# Altium project EVK-IRIS-W1-Mikro-Bus.PrjPcb (part 1 of 5)
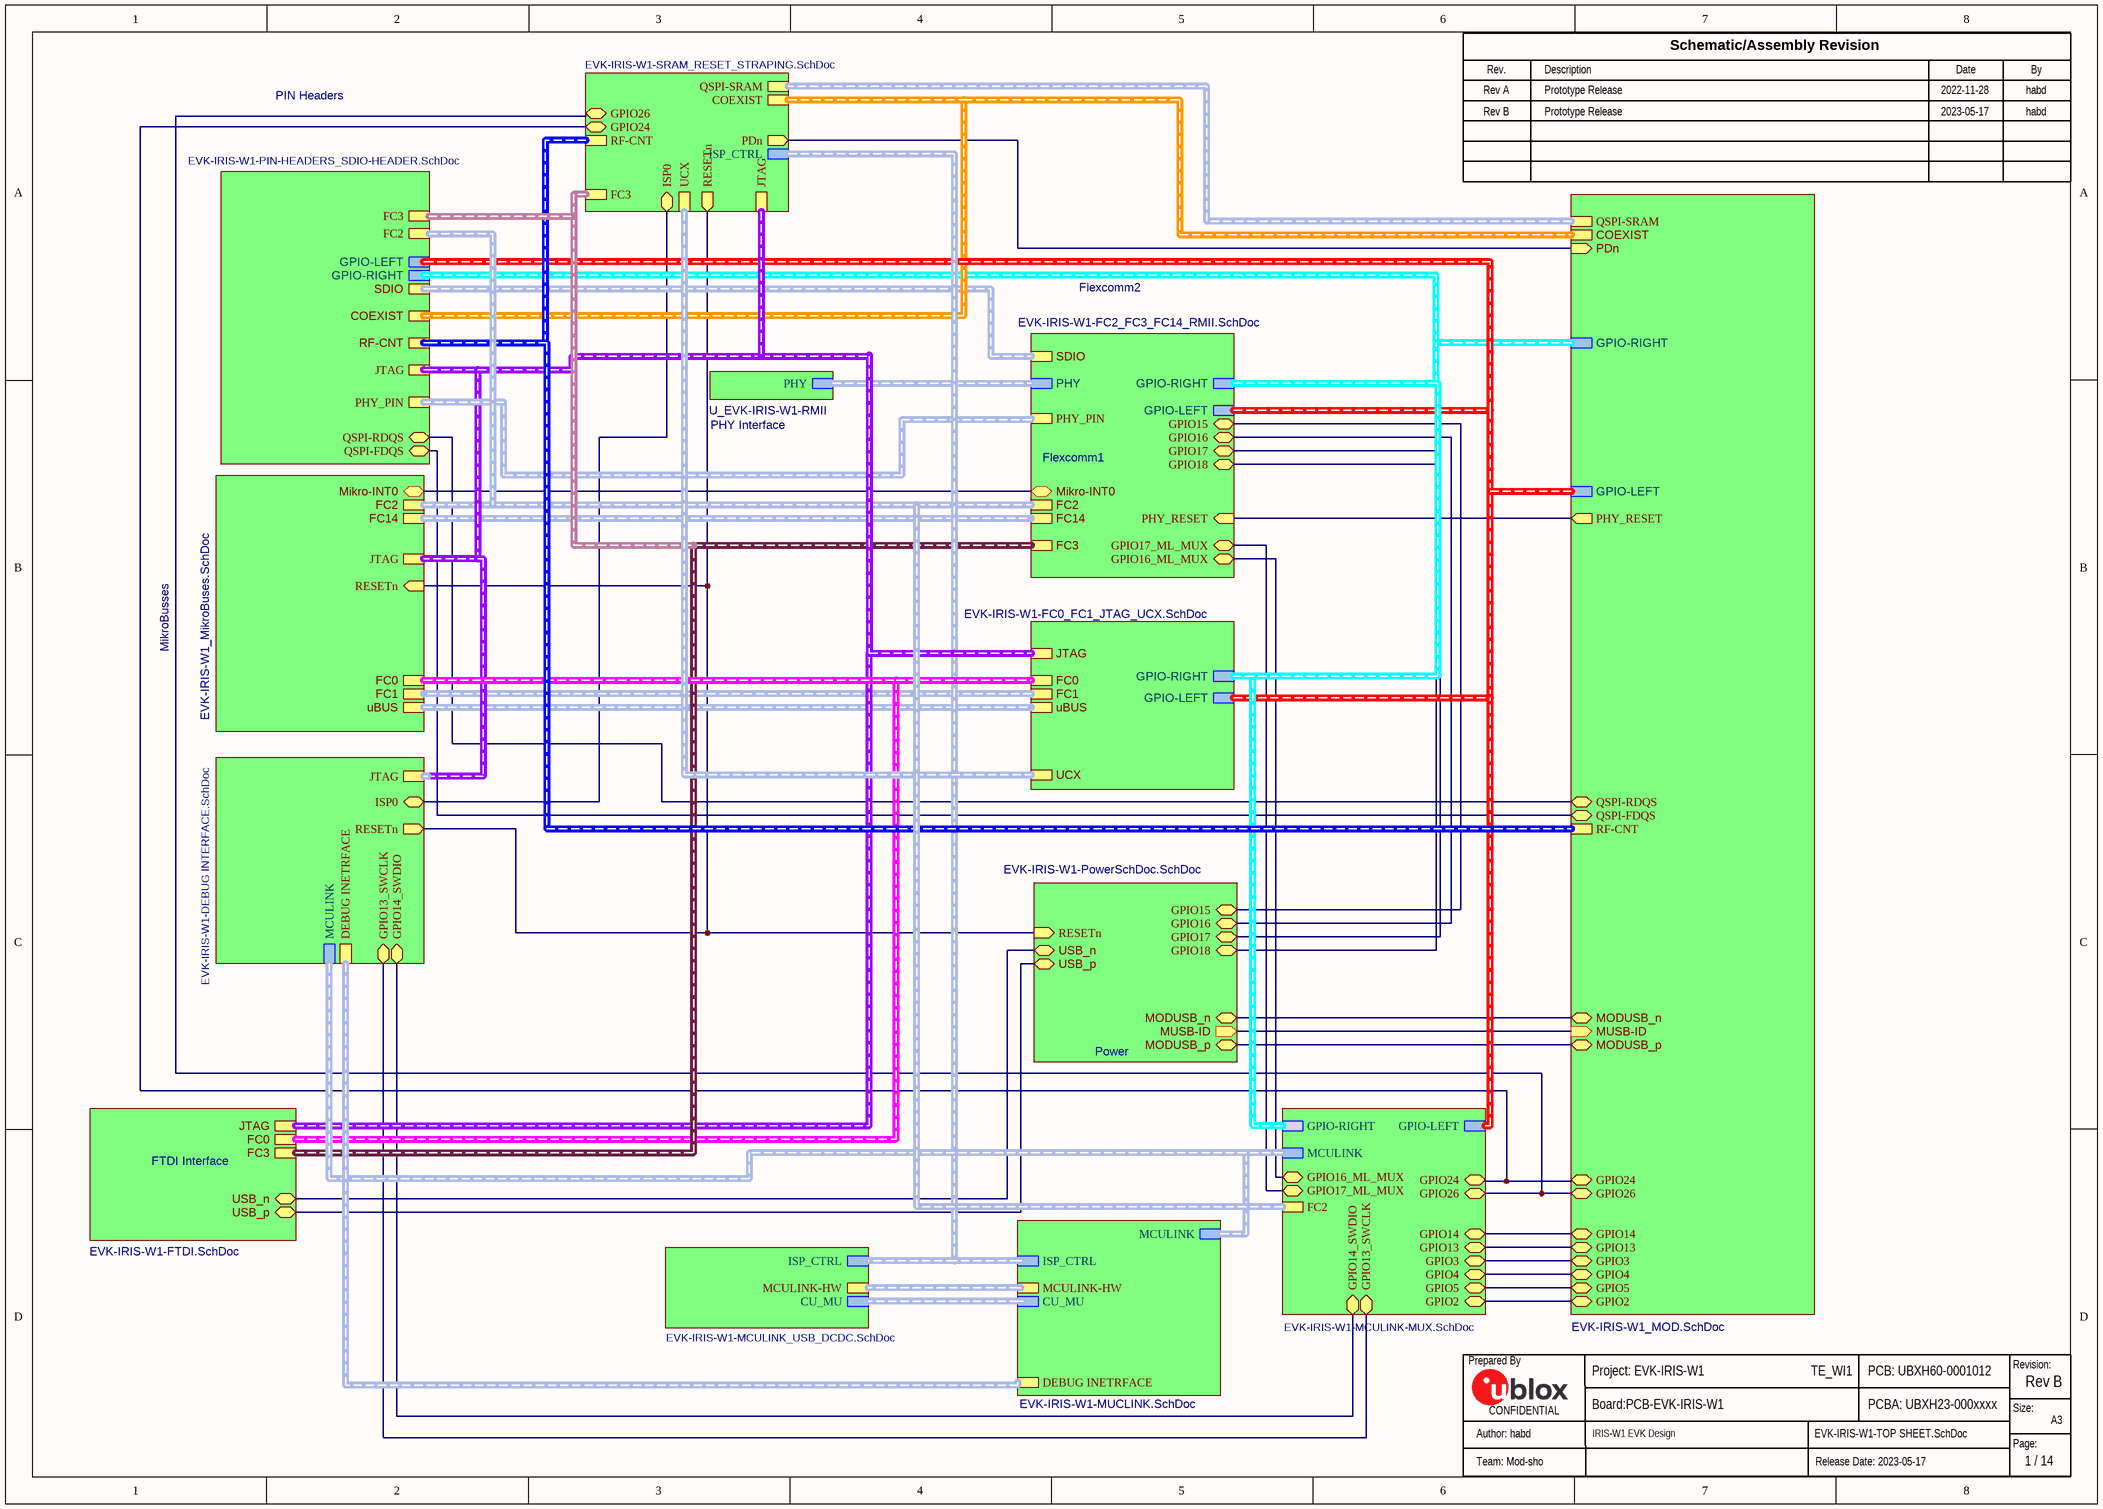
[diagram p0: EVK-IRIS-W1-TOP SHEET.SchDoc]
AssemblyUBXNum: UBXH23-000xxxx; GlobalClientName: u-blox; GlobalCompanyNmae: u-blox AG; GlobalProjectCode: TE_WI1; GlobalProjectDescription: IRIS-W1 EVK Design; GlobalProjectLink: www.u-blox.com; GlobalProjectName: EVK-IRIS-W1; GlobalProjectRevision: Rev B; GlobalProjectTeam: Mod-sho; GlobalReleaseDate: 2023-05-17; PCBDocNum: UBXH60-0001012; PCBName: PCB-EVK-IRIS-W1; PCBUBXNum: UBXH60-0001012; ProjectEngineer: habd; ReleaseBy1: habd; ReleaseBy2: habd; ReleaseDate1: 2022-11-28; ReleaseDate2: 2023-05-17; ReleaseDesc1: Prototype Release; ReleaseDesc2: Prototype Release; ReleaseRev1: Rev A; ReleaseRev2: Rev B; Revision: B; SchDocNum: XXX-XXXX-XX; SchSheetTotal: 14
14 sheets, 619 parts. Net scope: hierarchical (ports join the sheet entries above them; power ports are global).
Board file: EVK-IRIS-W1.PcbDoc
Sheets:
  EVK-IRIS-W1-TOP SHEET.SchDoc
    U_EVK-IRIS-W1-FC0_FC1_JTAG_UCX = EVK-IRIS-W1-FC0_FC1_JTAG_UCX.SchDoc
    U_EVK-IRIS-W1-FC2_FC3_FC14_RMII = EVK-IRIS-W1-FC2_FC3_FC14_RMII.SchDoc
    U_EVK-IRIS-W1-FTDI = EVK-IRIS-W1-FTDI.SchDoc
    U_EVK-IRIS-W1-PIN-HEADERS_SDIO-HEADER = EVK-IRIS-W1-PIN-HEADERS_SDIO-HEADER.SchDoc
    U_EVK-IRIS-W1-PowerSchDoc = EVK-IRIS-W1-PowerSchDoc.SchDoc
    U_EVK-IRIS-W1_MikroBuses = EVK-IRIS-W1_MikroBuses.SchDoc
    U_EVK-IRIS-W1_MOD = EVK-IRIS-W1_MOD.SchDoc
    U_EVK-IRIS-W1-RMII = EVK-IRIS-W1-RMII.SchDoc
    U_EVK-IRIS-W1-MCULINK-MUX = EVK-IRIS-W1-MCULINK-MUX.SchDoc
    U_EVK-IRIS-W1-MUCLINK = EVK-IRIS-W1-MUCLINK.SchDoc
    U_EVK-IRIS-W1-DEBUG INTERFACE = EVK-IRIS-W1-DEBUG INTERFACE.SchDoc
    U_EVK-IRIS-W1-MCULINK_USB_DCDC = EVK-IRIS-W1-MCULINK_USB_DCDC.SchDoc
    U_EVK-IRIS-W1-SRAM_RESET_STRAPING = EVK-IRIS-W1-SRAM_RESET_STRAPING.SchDoc

## Sheet EVK-IRIS-W1-TOP SHEET.SchDoc
size A3; DocumentNumber: 1; SheetNumber: 1; SheetTotal: 14

### Sub-sheets
U_EVK-IRIS-W1-DEBUG INTERFACE = EVK-IRIS-W1-DEBUG INTERFACE.SchDoc: JTAG (harness JTAG), GPIO13_SWCLK (bidir), GPIO14_SWDIO (bidir), DEBUG INETRFACE (harness DEBUG-INTERFACE), ISP0 (bidir), MCULINK (harness MCULINK), RESETn (out)
U_EVK-IRIS-W1-FC0_FC1_JTAG_UCX = EVK-IRIS-W1-FC0_FC1_JTAG_UCX.SchDoc: GPIO-RIGHT (harness GPIO-RIGHT), FC1 (harness FC1), JTAG (harness JTAG), FC0 (harness FC0), UCX (harness UCX), GPIO-LEFT (harness GPIO-LEFT), uBUS (harness uBUS)
U_EVK-IRIS-W1-FC2_FC3_FC14_RMII = EVK-IRIS-W1-FC2_FC3_FC14_RMII.SchDoc: GPIO-RIGHT (harness GPIO-RIGHT), PHY (harness PHY_HARNESS), FC14 (harness FC14), SDIO (harness SDIO), FC2 (harness FC2), FC3 (harness FC3), Mikro-INT0 (bidir), GPIO-LEFT (harness GPIO-LEFT), PHY_PIN (harness PHY_PIN HEADERS), PHY_RESET (in), GPIO15 (bidir), GPIO16 (bidir), GPIO17 (bidir), GPIO18 (bidir), GPIO16_ML_MUX (bidir), GPIO17_ML_MUX (bidir)
U_EVK-IRIS-W1-FTDI = EVK-IRIS-W1-FTDI.SchDoc: USB_n (bidir), USB_p (bidir), JTAG (harness JTAG), FC0 (harness FC0), FC3 (harness FC3)
U_EVK-IRIS-W1-MCULINK-MUX = EVK-IRIS-W1-MCULINK-MUX.SchDoc: GPIO-LEFT (harness GPIO-LEFT), GPIO-RIGHT (harness GPIO-RIGHT), GPIO24 (bidir), GPIO26 (bidir), GPIO14 (bidir), GPIO13 (bidir), GPIO3 (bidir), GPIO4 (bidir), GPIO5 (bidir), GPIO2 (bidir), MCULINK (harness MCULINK), GPIO14_SWDIO (bidir), GPIO13_SWCLK (bidir), GPIO16_ML_MUX (bidir), GPIO17_ML_MUX (bidir), FC2 (harness FC2)
U_EVK-IRIS-W1-MCULINK_USB_DCDC = EVK-IRIS-W1-MCULINK_USB_DCDC.SchDoc: MCULINK-HW (harness MCULINK_HW), CU_MU (harness CU_MU), ISP_CTRL (harness ISP_CTRL)
U_EVK-IRIS-W1-MUCLINK = EVK-IRIS-W1-MUCLINK.SchDoc: MCULINK-HW (harness MCULINK_HW), MCULINK (harness MCULINK), DEBUG INETRFACE (harness DEBUG-INTERFACE), CU_MU (harness CU_MU), ISP_CTRL (harness ISP_CTRL)
U_EVK-IRIS-W1-PIN-HEADERS_SDIO-HEADER = EVK-IRIS-W1-PIN-HEADERS_SDIO-HEADER.SchDoc: GPIO-RIGHT (harness GPIO-RIGHT), RF-CNT (harness RF-CNT), SDIO (harness SDIO), GPIO-LEFT (harness GPIO-LEFT), COEXIST (harness COEXIST), JTAG (harness JTAG), PHY_PIN (harness PHY_PIN HEADERS), QSPI-FDQS (bidir), QSPI-RDQS (bidir), FC2 (harness FC2), FC3 (harness FC3)
U_EVK-IRIS-W1-PowerSchDoc = EVK-IRIS-W1-PowerSchDoc.SchDoc: MODUSB_p (bidir), MODUSB_n (bidir), USB_n (bidir), USB_p (bidir), MUSB-ID (out), RESETn (in), GPIO16 (bidir), GPIO17 (bidir), GPIO18 (bidir), GPIO15 (bidir)
U_EVK-IRIS-W1-RMII = EVK-IRIS-W1-RMII.SchDoc: PHY (harness PHY_HARNESS)
U_EVK-IRIS-W1-SRAM_RESET_STRAPING = EVK-IRIS-W1-SRAM_RESET_STRAPING.SchDoc: PDn (out), QSPI-SRAM (harness QSPI-SRAM), RF-CNT (harness RF-CNT), COEXIST (harness COEXIST), ISP_CTRL (harness ISP_CTRL), ISP0 (bidir), GPIO24 (bidir), GPIO26 (bidir), UCX (harness UCX), FC3 (harness FC3), RESETn (out), JTAG (harness JTAG)
U_EVK-IRIS-W1_MikroBuses = EVK-IRIS-W1_MikroBuses.SchDoc: FC0 (harness FC0), Mikro-INT0 (bidir), FC14 (harness FC14), FC1 (harness FC1), FC2 (harness FC2), uBUS (harness uBUS), JTAG (harness JTAG), RESETn (in)
U_EVK-IRIS-W1_MOD = EVK-IRIS-W1_MOD.SchDoc: COEXIST (harness COEXIST), MODUSB_p (bidir), MODUSB_n (bidir), GPIO-RIGHT (harness GPIO-RIGHT), GPIO-LEFT (harness GPIO-LEFT), PDn (in), MUSB-ID (in), PHY_RESET (out), GPIO24 (bidir), GPIO26 (bidir), GPIO14 (bidir), GPIO13 (bidir), GPIO2 (bidir), GPIO3 (bidir), GPIO4 (bidir), GPIO5 (bidir), RF-CNT (harness RF-CNT), QSPI-RDQS (bidir), QSPI-SRAM (harness QSPI-SRAM), QSPI-FDQS (bidir)

### Nets
DBGIF_ISP0_CTRL: sheet U_EVK-IRIS-W1-DEBUG INTERFACE/ISP0, sheet U_EVK-IRIS-W1-SRAM_RESET_STRAPING/ISP0
GPIO2: sheet U_EVK-IRIS-W1_MOD/GPIO2, sheet U_EVK-IRIS-W1-MCULINK-MUX/GPIO2
GPIO3: sheet U_EVK-IRIS-W1_MOD/GPIO3, sheet U_EVK-IRIS-W1-MCULINK-MUX/GPIO3
GPIO4: sheet U_EVK-IRIS-W1_MOD/GPIO4, sheet U_EVK-IRIS-W1-MCULINK-MUX/GPIO4
GPIO5: sheet U_EVK-IRIS-W1_MOD/GPIO5, sheet U_EVK-IRIS-W1-MCULINK-MUX/GPIO5
GPIO13: sheet U_EVK-IRIS-W1_MOD/GPIO13, sheet U_EVK-IRIS-W1-MCULINK-MUX/GPIO13
GPIO13_SWCLK_ML: sheet U_EVK-IRIS-W1-MCULINK-MUX/GPIO13_SWCLK, sheet U_EVK-IRIS-W1-DEBUG INTERFACE/GPIO13_SWCLK
GPIO14: sheet U_EVK-IRIS-W1_MOD/GPIO14, sheet U_EVK-IRIS-W1-MCULINK-MUX/GPIO14
GPIO14_SWDIO_ML: sheet U_EVK-IRIS-W1-MCULINK-MUX/GPIO14_SWDIO, sheet U_EVK-IRIS-W1-DEBUG INTERFACE/GPIO14_SWDIO
GPIO15: sheet U_EVK-IRIS-W1-FC2_FC3_FC14_RMII/GPIO15, sheet U_EVK-IRIS-W1-PowerSchDoc/GPIO15
GPIO16: sheet U_EVK-IRIS-W1-FC2_FC3_FC14_RMII/GPIO16, sheet U_EVK-IRIS-W1-PowerSchDoc/GPIO16
GPIO17: sheet U_EVK-IRIS-W1-FC2_FC3_FC14_RMII/GPIO17, sheet U_EVK-IRIS-W1-PowerSchDoc/GPIO17
GPIO18: sheet U_EVK-IRIS-W1-FC2_FC3_FC14_RMII/GPIO18, sheet U_EVK-IRIS-W1-PowerSchDoc/GPIO18
GPIO18__Mikro-INT0: sheet U_EVK-IRIS-W1-FC2_FC3_FC14_RMII/Mikro-INT0, sheet U_EVK-IRIS-W1_MikroBuses/Mikro-INT0
GPIO24: sheet U_EVK-IRIS-W1_MOD/GPIO24, sheet U_EVK-IRIS-W1-MCULINK-MUX/GPIO24, sheet U_EVK-IRIS-W1-SRAM_RESET_STRAPING/GPIO24
GPIO26: sheet U_EVK-IRIS-W1_MOD/GPIO26, sheet U_EVK-IRIS-W1-MCULINK-MUX/GPIO26, sheet U_EVK-IRIS-W1-SRAM_RESET_STRAPING/GPIO26
GPIO29_QSPI-FDQS: sheet U_EVK-IRIS-W1-PIN-HEADERS_SDIO-HEADER/QSPI-FDQS, sheet U_EVK-IRIS-W1_MOD/QSPI-FDQS
MODUSB-D_n: sheet U_EVK-IRIS-W1-PowerSchDoc/MODUSB_n, sheet U_EVK-IRIS-W1_MOD/MODUSB_n
MODUSB-D_p: sheet U_EVK-IRIS-W1-PowerSchDoc/MODUSB_p, sheet U_EVK-IRIS-W1_MOD/MODUSB_p
MUSB-ID: sheet U_EVK-IRIS-W1-PowerSchDoc/MUSB-ID, sheet U_EVK-IRIS-W1_MOD/MUSB-ID
PDn: sheet U_EVK-IRIS-W1_MOD/PDn, sheet U_EVK-IRIS-W1-SRAM_RESET_STRAPING/PDn
PHY_RESET: sheet U_EVK-IRIS-W1-FC2_FC3_FC14_RMII/PHY_RESET, sheet U_EVK-IRIS-W1_MOD/PHY_RESET
QSPI-RDQS: sheet U_EVK-IRIS-W1-PIN-HEADERS_SDIO-HEADER/QSPI-RDQS, sheet U_EVK-IRIS-W1_MOD/QSPI-RDQS
RESETn: sheet U_EVK-IRIS-W1-PowerSchDoc/RESETn, sheet U_EVK-IRIS-W1_MikroBuses/RESETn, sheet U_EVK-IRIS-W1-DEBUG INTERFACE/RESETn, sheet U_EVK-IRIS-W1-SRAM_RESET_STRAPING/RESETn
USB-D_n: sheet U_EVK-IRIS-W1-FTDI/USB_n, sheet U_EVK-IRIS-W1-PowerSchDoc/USB_n
USB-D_p: sheet U_EVK-IRIS-W1-FTDI/USB_p, sheet U_EVK-IRIS-W1-PowerSchDoc/USB_p
NetJ56_1: sheet U_EVK-IRIS-W1-FC2_FC3_FC14_RMII/GPIO16_ML_MUX, sheet U_EVK-IRIS-W1-MCULINK-MUX/GPIO16_ML_MUX
NetJ57_1: sheet U_EVK-IRIS-W1-FC2_FC3_FC14_RMII/GPIO17_ML_MUX, sheet U_EVK-IRIS-W1-MCULINK-MUX/GPIO17_ML_MUX

### Buses and harness runs
harness sheet U_EVK-IRIS-W1-DEBUG INTERFACE/DEBUG INETRFACE = sheet U_EVK-IRIS-W1-MUCLINK/DEBUG INETRFACE
harness sheet U_EVK-IRIS-W1-DEBUG INTERFACE/JTAG = sheet U_EVK-IRIS-W1-FC0_FC1_JTAG_UCX/JTAG = sheet U_EVK-IRIS-W1-FTDI/JTAG = sheet U_EVK-IRIS-W1-PIN-HEADERS_SDIO-HEADER/JTAG = sheet U_EVK-IRIS-W1-SRAM_RESET_STRAPING/JTAG = sheet U_EVK-IRIS-W1_MikroBuses/JTAG
harness sheet U_EVK-IRIS-W1-DEBUG INTERFACE/MCULINK = sheet U_EVK-IRIS-W1-MCULINK-MUX/MCULINK = sheet U_EVK-IRIS-W1-MUCLINK/MCULINK
harness sheet U_EVK-IRIS-W1-FC0_FC1_JTAG_UCX/FC0 = sheet U_EVK-IRIS-W1-FTDI/FC0 = sheet U_EVK-IRIS-W1_MikroBuses/FC0
harness sheet U_EVK-IRIS-W1-FC0_FC1_JTAG_UCX/FC1 = sheet U_EVK-IRIS-W1_MikroBuses/FC1
harness sheet U_EVK-IRIS-W1-FC0_FC1_JTAG_UCX/GPIO-LEFT = sheet U_EVK-IRIS-W1-FC2_FC3_FC14_RMII/GPIO-LEFT = sheet U_EVK-IRIS-W1-MCULINK-MUX/GPIO-LEFT = sheet U_EVK-IRIS-W1-PIN-HEADERS_SDIO-HEADER/GPIO-LEFT = sheet U_EVK-IRIS-W1_MOD/GPIO-LEFT
harness sheet U_EVK-IRIS-W1-FC0_FC1_JTAG_UCX/GPIO-RIGHT = sheet U_EVK-IRIS-W1-FC2_FC3_FC14_RMII/GPIO-RIGHT = sheet U_EVK-IRIS-W1-MCULINK-MUX/GPIO-RIGHT = sheet U_EVK-IRIS-W1-PIN-HEADERS_SDIO-HEADER/GPIO-RIGHT = sheet U_EVK-IRIS-W1_MOD/GPIO-RIGHT
harness sheet U_EVK-IRIS-W1-FC0_FC1_JTAG_UCX/uBUS = sheet U_EVK-IRIS-W1_MikroBuses/uBUS
harness sheet U_EVK-IRIS-W1-FC0_FC1_JTAG_UCX/UCX = sheet U_EVK-IRIS-W1-SRAM_RESET_STRAPING/UCX
harness sheet U_EVK-IRIS-W1-FC2_FC3_FC14_RMII/FC2 = sheet U_EVK-IRIS-W1-MCULINK-MUX/FC2 = sheet U_EVK-IRIS-W1-PIN-HEADERS_SDIO-HEADER/FC2 = sheet U_EVK-IRIS-W1_MikroBuses/FC2
harness sheet U_EVK-IRIS-W1-FC2_FC3_FC14_RMII/FC3 = sheet U_EVK-IRIS-W1-FTDI/FC3 = sheet U_EVK-IRIS-W1-PIN-HEADERS_SDIO-HEADER/FC3 = sheet U_EVK-IRIS-W1-SRAM_RESET_STRAPING/FC3
harness sheet U_EVK-IRIS-W1-FC2_FC3_FC14_RMII/FC14 = sheet U_EVK-IRIS-W1_MikroBuses/FC14
harness sheet U_EVK-IRIS-W1-FC2_FC3_FC14_RMII/PHY = sheet U_EVK-IRIS-W1-RMII/PHY
harness sheet U_EVK-IRIS-W1-FC2_FC3_FC14_RMII/PHY_PIN = sheet U_EVK-IRIS-W1-PIN-HEADERS_SDIO-HEADER/PHY_PIN
harness sheet U_EVK-IRIS-W1-FC2_FC3_FC14_RMII/SDIO = sheet U_EVK-IRIS-W1-PIN-HEADERS_SDIO-HEADER/SDIO
harness sheet U_EVK-IRIS-W1-MCULINK_USB_DCDC/CU_MU = sheet U_EVK-IRIS-W1-MUCLINK/CU_MU
harness sheet U_EVK-IRIS-W1-MCULINK_USB_DCDC/ISP_CTRL = sheet U_EVK-IRIS-W1-MUCLINK/ISP_CTRL = sheet U_EVK-IRIS-W1-SRAM_RESET_STRAPING/ISP_CTRL
harness sheet U_EVK-IRIS-W1-MCULINK_USB_DCDC/MCULINK-HW = sheet U_EVK-IRIS-W1-MUCLINK/MCULINK-HW
harness sheet U_EVK-IRIS-W1-PIN-HEADERS_SDIO-HEADER/COEXIST = sheet U_EVK-IRIS-W1-SRAM_RESET_STRAPING/COEXIST = sheet U_EVK-IRIS-W1_MOD/COEXIST
harness sheet U_EVK-IRIS-W1-PIN-HEADERS_SDIO-HEADER/RF-CNT = sheet U_EVK-IRIS-W1-SRAM_RESET_STRAPING/RF-CNT = sheet U_EVK-IRIS-W1_MOD/RF-CNT
harness sheet U_EVK-IRIS-W1-SRAM_RESET_STRAPING/QSPI-SRAM = sheet U_EVK-IRIS-W1_MOD/QSPI-SRAM

### Notes on the sheet
- PIN Headers
- Flexcomm2
- PHY Interface
- Flexcomm1
- MikroBusses
- Power
- FTDI Interface
- Rev.
- Description
- Schematic/Assembly Revision
- Date
- By
- Prepared By
- Revision:
- CONFIDENTIAL
- Page:
- Size:
- A3

## Sheet EVK-IRIS-W1-FC0_FC1_JTAG_UCX.SchDoc: Top Level Design
size A3; CompanyName: Rigado, LLC; Organization: Rigado; DocumentNumber: 4; SheetNumber: 4; SheetTotal: 14; Website: www.rigado.com; SheetSize: B
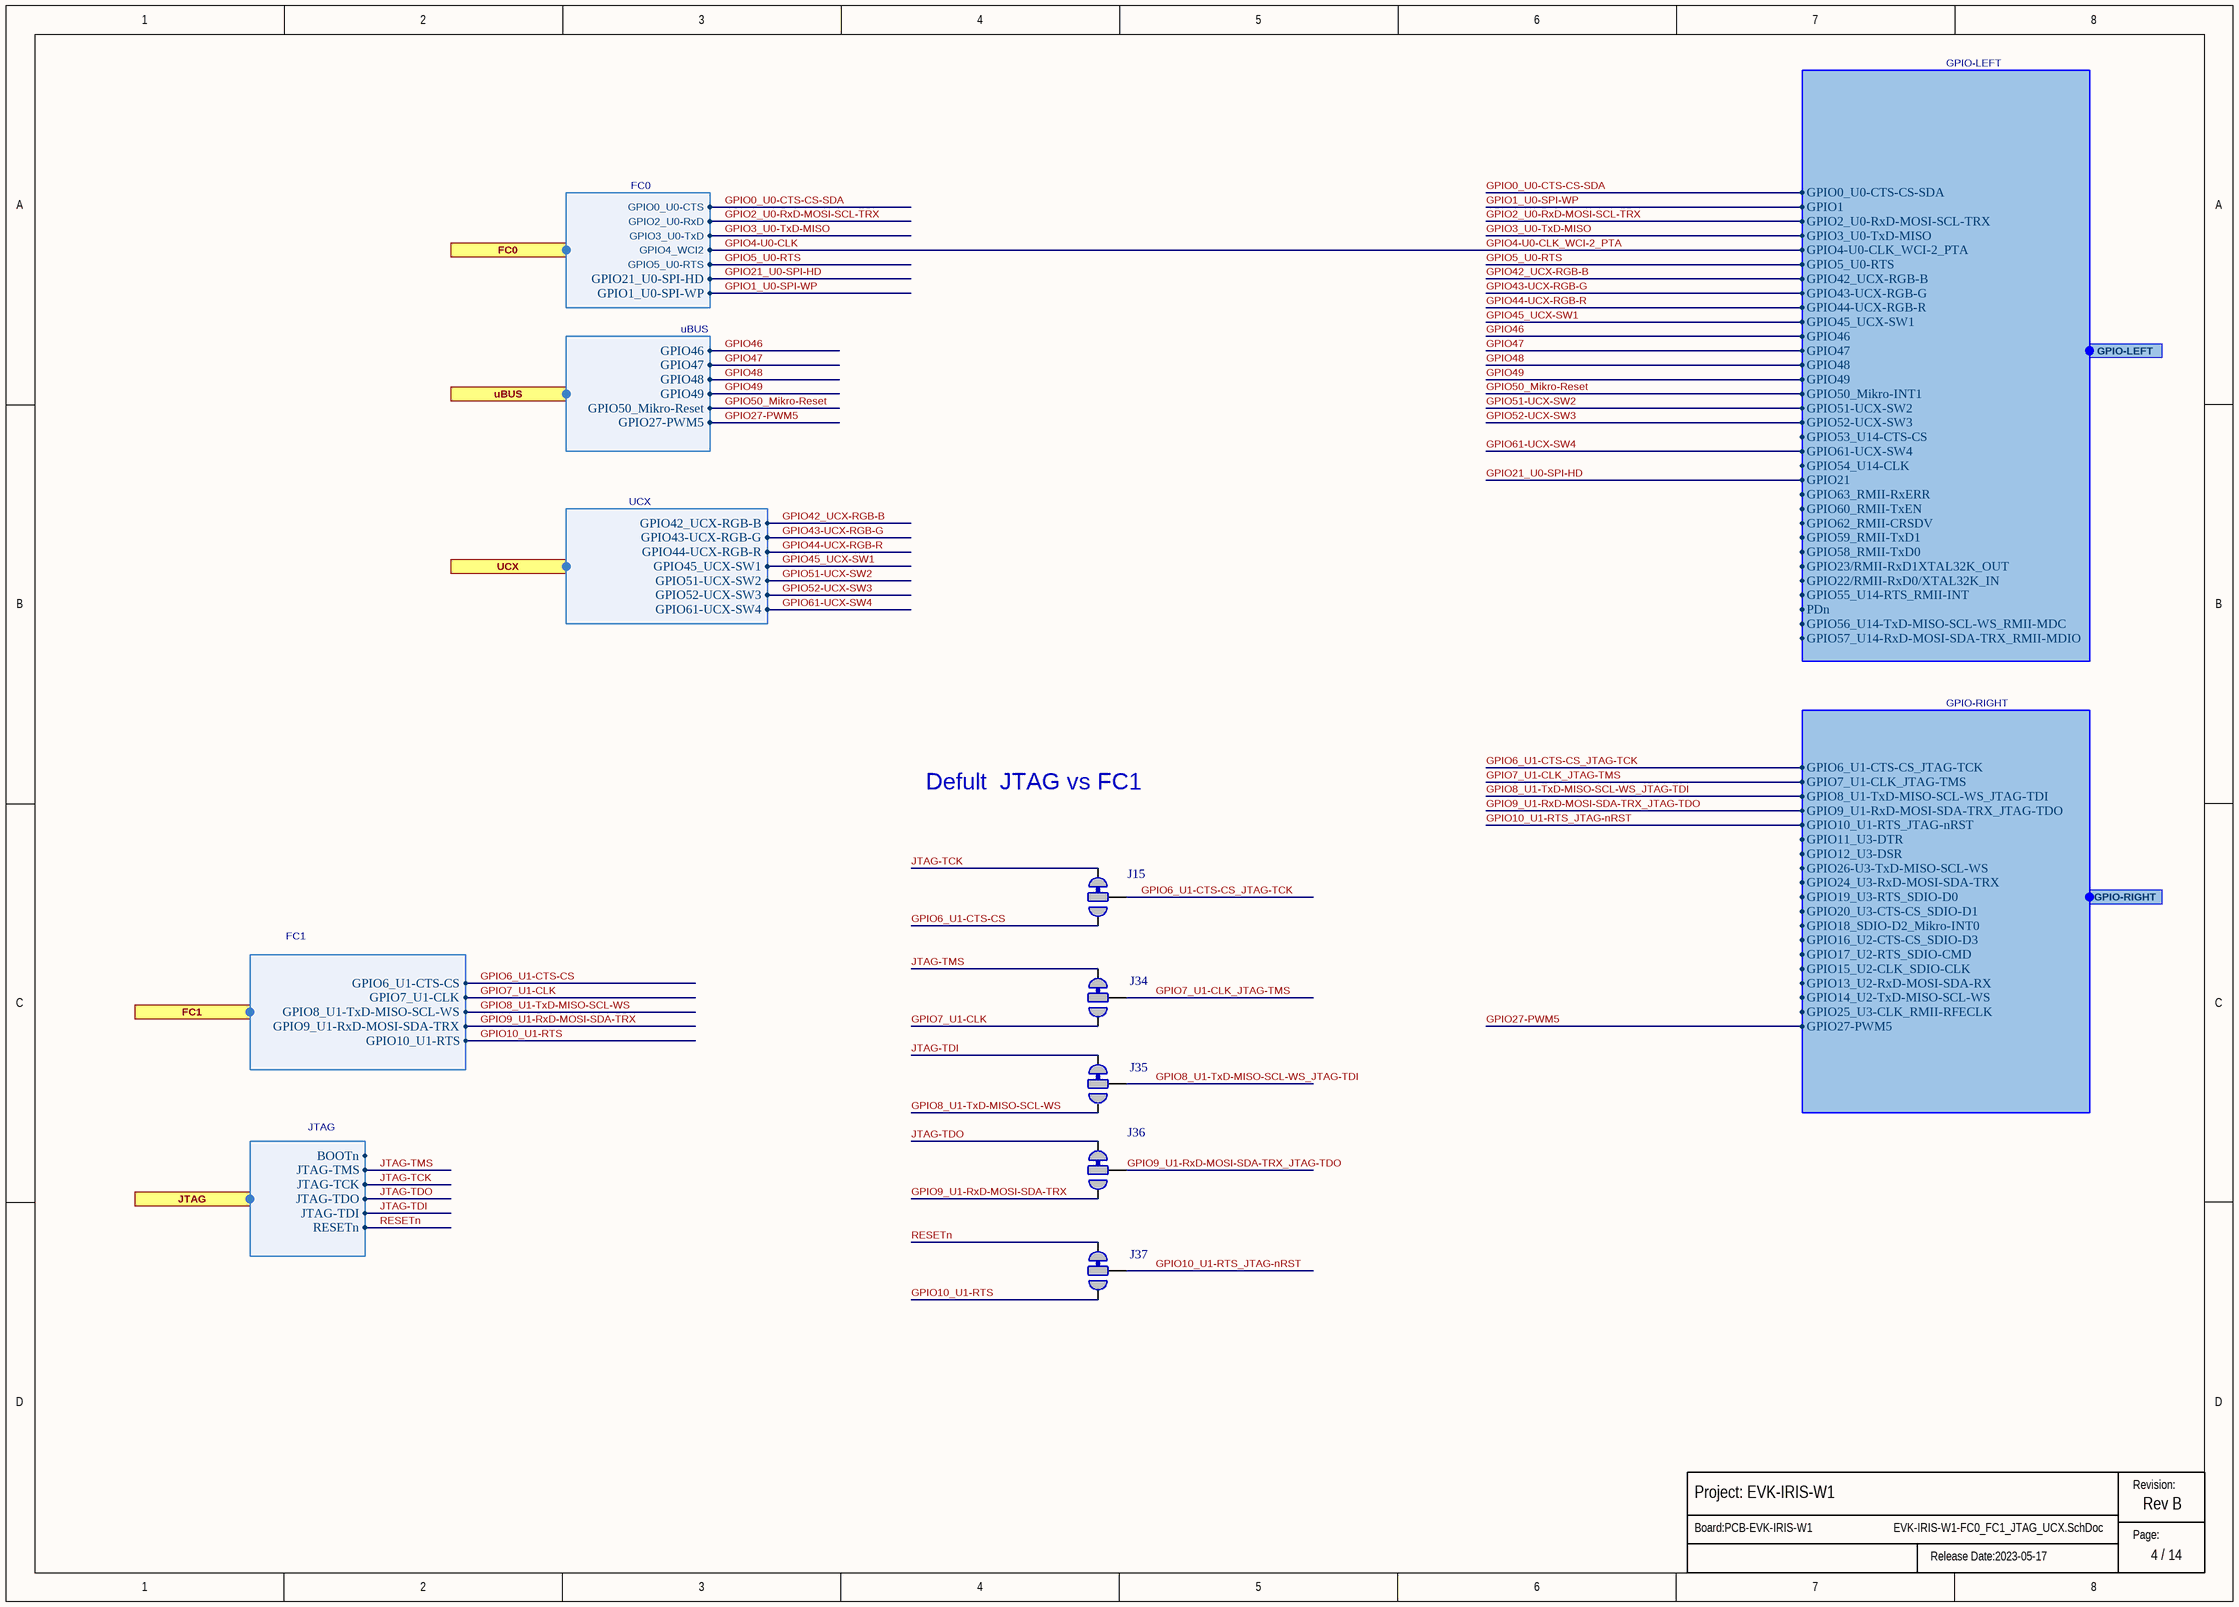
[diagram p1: EVK-IRIS-W1-FC0_FC1_JTAG_UCX.SchDoc]

### Parts
J15  Solderbridge-OptionDNP  [Solderbridge-Option]  (value not drawn)  (net tie, no BOM)
J34  Solderbridge-OptionDNP  [Solderbridge-Option]  (value not drawn)  (net tie, no BOM)
J35  Solderbridge-OptionDNP  [Solderbridge-Option]  (value not drawn)  (net tie, no BOM)
J36  Solderbridge-OptionDNP  [Solderbridge-Option]  (value not drawn)  (net tie, no BOM)
J37  Solderbridge-OptionDNP  [Solderbridge-Option]  (value not drawn)  (net tie, no BOM)

### Ports
FC0 (harness FC0), FC1 (harness FC1), GPIO-LEFT (harness GPIO-LEFT), GPIO-RIGHT (harness GPIO-RIGHT), JTAG (harness JTAG), uBUS (harness uBUS), UCX (harness UCX)

### Harnesses
GPIO-RIGHT: GPIO6_U1-CTS-CS_JTAG-TCK, GPIO7_U1-CLK_JTAG-TMS, GPIO8_U1-TxD-MISO-SCL-WS_JTAG-TDI, GPIO9_U1-RxD-MOSI-SDA-TRX_JTAG-TDO, GPIO10_U1-RTS_JTAG-nRST, GPIO11_U3-DTR, GPIO12_U3-DSR, GPIO26-U3-TxD-MISO-SCL-WS, GPIO24_U3-RxD-MOSI-SDA-TRX, GPIO19_U3-RTS_SDIO-D0, GPIO20_U3-CTS-CS_SDIO-D1, GPIO18_SDIO-D2_Mikro-INT0, GPIO16_U2-CTS-CS_SDIO-D3, GPIO17_U2-RTS_SDIO-CMD, GPIO15_U2-CLK_SDIO-CLK, GPIO13_U2-RxD-MOSI-SDA-RX, GPIO14_U2-TxD-MISO-SCL-WS, GPIO25_U3-CLK_RMII-RFECLK, GPIO27-PWM5
JTAG: JTAG-TCK, JTAG-TDI, JTAG-TDO, JTAG-TMS, RESETn, BOOTn
FC1: GPIO6_U1-CTS-CS, GPIO7_U1-CLK, GPIO8_U1-TxD-MISO-SCL-WS, GPIO9_U1-RxD-MOSI-SDA-TRX, GPIO10_U1-RTS
FC0: GPIO0_U0-CTS, GPIO2_U0-RxD, GPIO3_U0-TxD, GPIO5_U0-RTS, GPIO4_WCI2, GPIO21_U0-SPI-HD, GPIO1_U0-SPI-WP
UCX: GPIO42_UCX-RGB-B, GPIO43-UCX-RGB-G, GPIO44-UCX-RGB-R, GPIO45_UCX-SW1, GPIO51-UCX-SW2, GPIO52-UCX-SW3, GPIO61-UCX-SW4
uBUS: GPIO46, GPIO47, GPIO48, GPIO49, GPIO50_Mikro-Reset, GPIO27-PWM5
GPIO-LEFT: GPIO0_U0-CTS-CS-SDA, GPIO1, GPIO2_U0-RxD-MOSI-SCL-TRX, GPIO3_U0-TxD-MISO, GPIO4-U0-CLK_WCI-2_PTA, GPIO5_U0-RTS, GPIO42_UCX-RGB-B, GPIO43-UCX-RGB-G, GPIO44-UCX-RGB-R, GPIO45_UCX-SW1, GPIO46, GPIO47, GPIO48, GPIO49, GPIO50_Mikro-INT1, GPIO51-UCX-SW2, GPIO52-UCX-SW3, GPIO53_U14-CTS-CS, GPIO61-UCX-SW4, GPIO54_U14-CLK, GPIO21, GPIO63_RMII-RxERR, GPIO60_RMII-TxEN, GPIO62_RMII-CRSDV, GPIO59_RMII-TxD1, GPIO58_RMII-TxD0, GPIO23/RMII-RxD1XTAL32K_OUT, GPIO22/RMII-RxD0/XTAL32K_IN, GPIO55_U14-RTS_RMII-INT, PDn, GPIO56_U14-TxD-MISO-SCL-WS_RMII-MDC, GPIO57_U14-RxD-MOSI-SDA-TRX_RMII-MDIO

### Nets
GPIO0_U0-CTS-CS-SDA: port FC0.GPIO0_U0-CTS, port GPIO-LEFT.GPIO0_U0-CTS-CS-SDA
GPIO1_U0-SPI-WP: port FC0.GPIO1_U0-SPI-WP, port GPIO-LEFT.GPIO1
GPIO2_U0-RxD-MOSI-SCL-TRX: port FC0.GPIO2_U0-RxD, port GPIO-LEFT.GPIO2_U0-RxD-MOSI-SCL-TRX
GPIO3_U0-TxD-MISO: port FC0.GPIO3_U0-TxD, port GPIO-LEFT.GPIO3_U0-TxD-MISO
GPIO4-U0-CLK: port FC0.GPIO4_WCI2, port GPIO-LEFT.GPIO4-U0-CLK_WCI-2_PTA  [also labelled GPIO4-U0-CLK_WCI-2_PTA]
GPIO6_U1-CTS-CS: J15.3 ; port FC1.GPIO6_U1-CTS-CS
GPIO6_U1-CTS-CS_JTAG-TCK: J15.2 ; port GPIO-RIGHT.GPIO6_U1-CTS-CS_JTAG-TCK
GPIO7_U1-CLK: J34.3 ; port FC1.GPIO7_U1-CLK
GPIO7_U1-CLK_JTAG-TMS: J34.2 ; port GPIO-RIGHT.GPIO7_U1-CLK_JTAG-TMS
GPIO8_U1-TxD-MISO-SCL-WS: J35.3 ; port FC1.GPIO8_U1-TxD-MISO-SCL-WS
GPIO8_U1-TxD-MISO-SCL-WS_JTAG-TDI: J35.2 ; port GPIO-RIGHT.GPIO8_U1-TxD-MISO-SCL-WS_JTAG-TDI
GPIO9_U1-RxD-MOSI-SDA-TRX: J36.3 ; port FC1.GPIO9_U1-RxD-MOSI-SDA-TRX
GPIO9_U1-RxD-MOSI-SDA-TRX_JTAG-TDO: J36.2 ; port GPIO-RIGHT.GPIO9_U1-RxD-MOSI-SDA-TRX_JTAG-TDO
GPIO10_U1-RTS: J37.3 ; port FC1.GPIO10_U1-RTS
GPIO10_U1-RTS_JTAG-nRST: J37.2 ; port GPIO-RIGHT.GPIO10_U1-RTS_JTAG-nRST
GPIO21_U0-SPI-HD: port FC0.GPIO21_U0-SPI-HD, port GPIO-LEFT.GPIO21
GPIO27-PWM5: port GPIO-RIGHT.GPIO27-PWM5, port uBUS.GPIO27-PWM5
GPIO42_UCX-RGB-B: port UCX.GPIO42_UCX-RGB-B, port GPIO-LEFT.GPIO42_UCX-RGB-B
GPIO43-UCX-RGB-G: port UCX.GPIO43-UCX-RGB-G, port GPIO-LEFT.GPIO43-UCX-RGB-G
GPIO44-UCX-RGB-R: port UCX.GPIO44-UCX-RGB-R, port GPIO-LEFT.GPIO44-UCX-RGB-R
GPIO45_UCX-SW1: port UCX.GPIO45_UCX-SW1, port GPIO-LEFT.GPIO45_UCX-SW1
GPIO46: port uBUS.GPIO46, port GPIO-LEFT.GPIO46
GPIO47: port uBUS.GPIO47, port GPIO-LEFT.GPIO47
GPIO48: port uBUS.GPIO48, port GPIO-LEFT.GPIO48
GPIO49: port uBUS.GPIO49, port GPIO-LEFT.GPIO49
GPIO50_Mikro-Reset: port uBUS.GPIO50_Mikro-Reset, port GPIO-LEFT.GPIO50_Mikro-INT1
GPIO51-UCX-SW2: port UCX.GPIO51-UCX-SW2, port GPIO-LEFT.GPIO51-UCX-SW2
GPIO52-UCX-SW3: port UCX.GPIO52-UCX-SW3, port GPIO-LEFT.GPIO52-UCX-SW3
GPIO61-UCX-SW4: port UCX.GPIO61-UCX-SW4, port GPIO-LEFT.GPIO61-UCX-SW4
JTAG-TCK: J15.1 ; port JTAG.JTAG-TCK
JTAG-TDI: J35.1 ; port JTAG.JTAG-TDI
JTAG-TDO: J36.1 ; port JTAG.JTAG-TDO
JTAG-TMS: J34.1 ; port JTAG.JTAG-TMS
RESETn: J37.1 ; port JTAG.RESETn

### Notes on the sheet
- Defult  JTAG vs FC1
- Revision:
- Page:

### Library data of the parts
J15 J34-J37 = Solderbridge-Option: Added By: Paul B; Part Number: Solderbridge-Option; Height: 0; DNP: DNP; Added Date: 2015-12-03

## Sheet EVK-IRIS-W1-FC2_FC3_FC14_RMII.SchDoc
size A3; DocumentNumber: 5; SheetNumber: 5; SheetTotal: 14
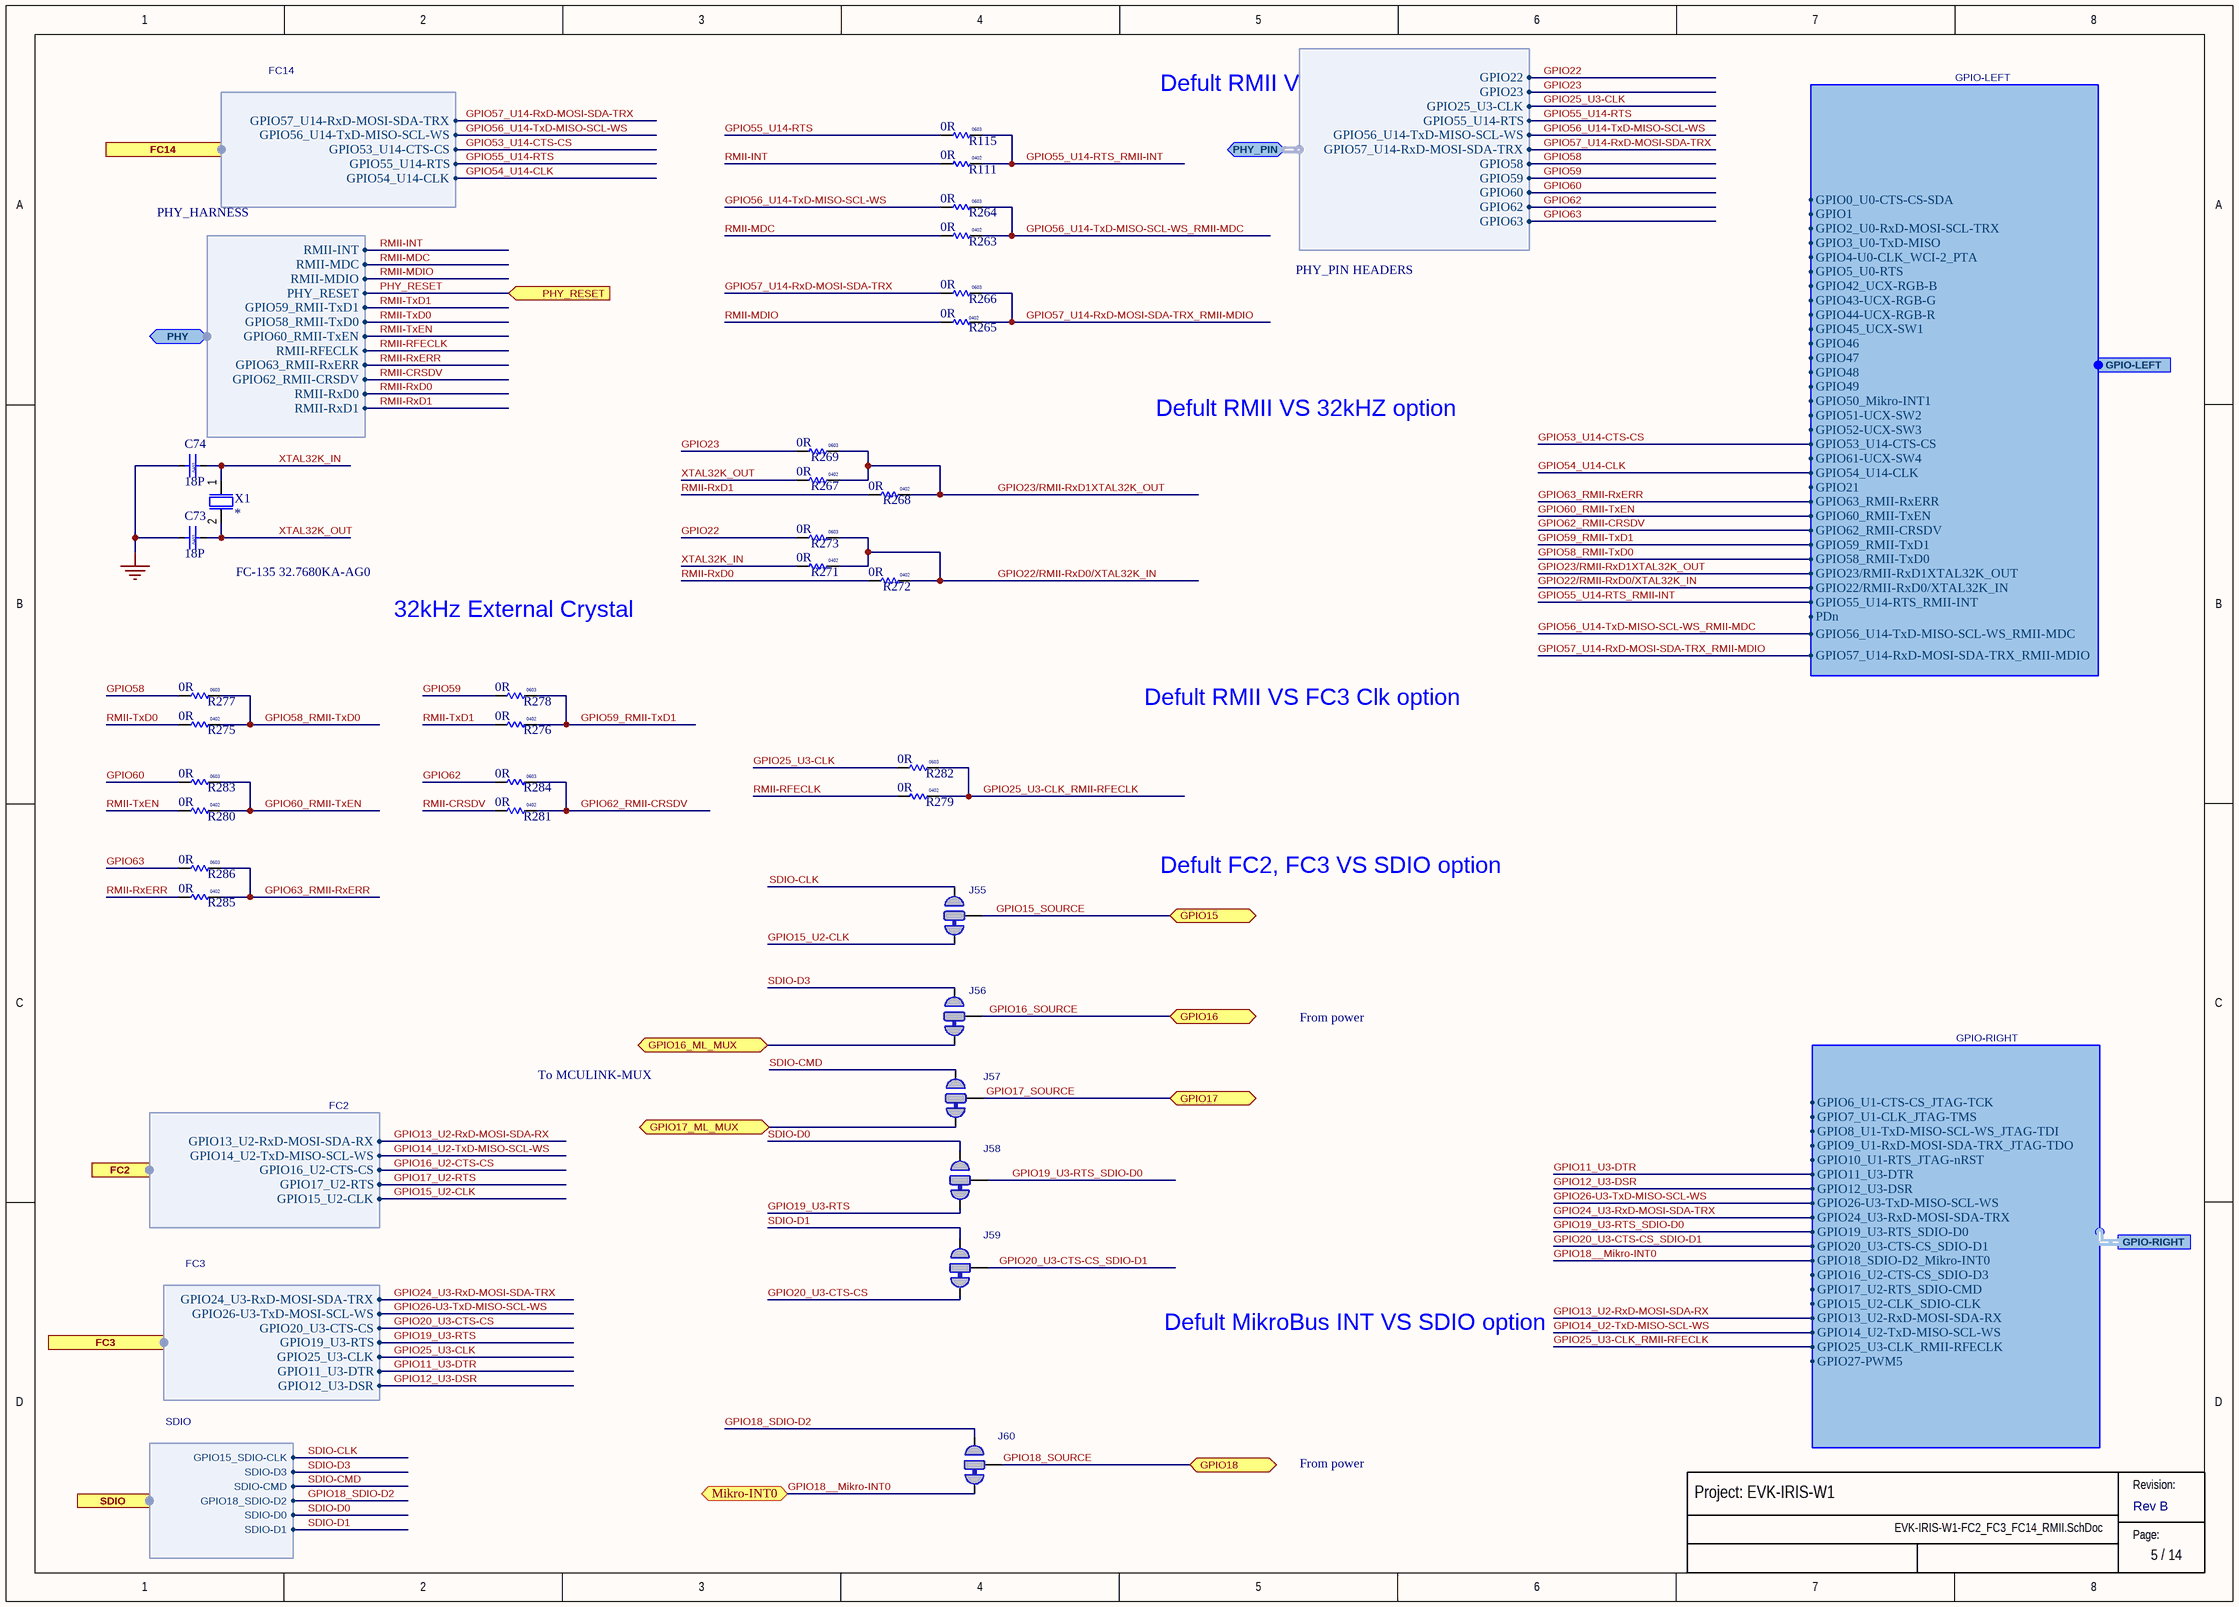
[diagram p2: EVK-IRIS-W1-FC2_FC3_FC14_RMII.SchDoc]

### Parts
C73  value 18P  Size: 0402  [Cap 0402]
C74  value 18P  Size: 0402  [Cap 0402]
J55  Solderbridge-OptionDNP  [Solderbridge-Option]  (value not drawn)  (net tie, no BOM)
J56  Solderbridge-OptionDNP  [Solderbridge-Option]  (value not drawn)  (net tie, no BOM)
J57  Solderbridge-OptionDNP  [Solderbridge-Option]  (value not drawn)  (net tie, no BOM)
J58  Solderbridge-OptionDNP  [Solderbridge-Option]  (value not drawn)  (net tie, no BOM)
J59  Solderbridge-OptionDNP  [Solderbridge-Option]  (value not drawn)  (net tie, no BOM)
J60  Solderbridge-OptionDNP  [Solderbridge-Option]  (value not drawn)  (net tie, no BOM)
R111  value 0R  Size: 0402  [RES 0402 HD]
R115  value 0R  Size: 0603  [RES 0603 HD]
R263  value 0R  Size: 0402  [RES 0402 HD]
R264  value 0R  Size: 0603  [RES 0603 HD]
R265  value 0R  Size: 0402  [RES 0402 HD]
R266  value 0R  Size: 0603  [RES 0603 HD]
R267  value 0R  Size: 0402  [RES 0402 HD]
R268  value 0R  Size: 0402  [RES 0402 HD]
R269  value 0R  Size: 0603  [RES 0603 HD]
R271  value 0R  Size: 0402  [RES 0402 HD]
R272  value 0R  Size: 0402  [RES 0402 HD]
R273  value 0R  Size: 0603  [RES 0603 HD]
R275  value 0R  Size: 0402  [RES 0402 HD]
R276  value 0R  Size: 0402  [RES 0402 HD]
R277  value 0R  Size: 0603  [RES 0603 HD]
R278  value 0R  Size: 0603  [RES 0603 HD]
R279  value 0R  Size: 0402  [RES 0402 HD]
R280  value 0R  Size: 0402  [RES 0402 HD]
R281  value 0R  Size: 0402  [RES 0402 HD]
R282  value 0R  Size: 0603  [RES 0603 HD]
R283  value 0R  Size: 0603  [RES 0603 HD]
R284  value 0R  Size: 0603  [RES 0603 HD]
R285  value 0R  Size: 0402  [RES 0402 HD]
R286  value 0R  Size: 0603  [RES 0603 HD]
X1  (no value)  [XTAL_3215]

### Ports
FC2 (harness FC2), FC3 (harness FC3), FC14 (harness FC14), GPIO15 (bidir), GPIO16 (bidir), GPIO16_ML_MUX (bidir), GPIO17 (bidir), GPIO17_ML_MUX (bidir), GPIO18 (bidir), GPIO-LEFT (harness GPIO-LEFT), GPIO-RIGHT (harness GPIO-RIGHT), Mikro-INT0 (bidir), PHY (bidir, harness PHY_HARNESS), PHY_PIN (bidir, harness PHY_PIN HEADERS), PHY_RESET (in), SDIO (harness SDIO)

### Harnesses
GPIO-RIGHT: GPIO6_U1-CTS-CS_JTAG-TCK, GPIO7_U1-CLK_JTAG-TMS, GPIO8_U1-TxD-MISO-SCL-WS_JTAG-TDI, GPIO9_U1-RxD-MOSI-SDA-TRX_JTAG-TDO, GPIO10_U1-RTS_JTAG-nRST, GPIO11_U3-DTR, GPIO12_U3-DSR, GPIO26-U3-TxD-MISO-SCL-WS, GPIO24_U3-RxD-MOSI-SDA-TRX, GPIO19_U3-RTS_SDIO-D0, GPIO20_U3-CTS-CS_SDIO-D1, GPIO18_SDIO-D2_Mikro-INT0, GPIO16_U2-CTS-CS_SDIO-D3, GPIO17_U2-RTS_SDIO-CMD, GPIO15_U2-CLK_SDIO-CLK, GPIO13_U2-RxD-MOSI-SDA-RX, GPIO14_U2-TxD-MISO-SCL-WS, GPIO25_U3-CLK_RMII-RFECLK, GPIO27-PWM5
PHY_HARNESS: RMII-MDIO, RMII-MDC, PHY_RESET, RMII-INT, GPIO59_RMII-TxD1, GPIO58_RMII-TxD0, GPIO60_RMII-TxEN, RMII-RFECLK, GPIO63_RMII-RxERR, GPIO62_RMII-CRSDV, RMII-RxD0, RMII-RxD1
FC14: GPIO57_U14-RxD-MOSI-SDA-TRX, GPIO56_U14-TxD-MISO-SCL-WS, GPIO53_U14-CTS-CS, GPIO55_U14-RTS, GPIO54_U14-CLK
SDIO: GPIO15_SDIO-CLK, SDIO-D3, SDIO-CMD, GPIO18_SDIO-D2, SDIO-D0, SDIO-D1
FC2: GPIO13_U2-RxD-MOSI-SDA-RX, GPIO14_U2-TxD-MISO-SCL-WS, GPIO16_U2-CTS-CS, GPIO17_U2-RTS, GPIO15_U2-CLK
FC3: GPIO20_U3-CTS-CS, GPIO19_U3-RTS, GPIO24_U3-RxD-MOSI-SDA-TRX, GPIO26-U3-TxD-MOSI-SCL-WS, GPIO25_U3-CLK, GPIO11_U3-DTR, GPIO12_U3-DSR
GPIO-LEFT: GPIO0_U0-CTS-CS-SDA, GPIO1, GPIO2_U0-RxD-MOSI-SCL-TRX, GPIO3_U0-TxD-MISO, GPIO4-U0-CLK_WCI-2_PTA, GPIO5_U0-RTS, GPIO42_UCX-RGB-B, GPIO43-UCX-RGB-G, GPIO44-UCX-RGB-R, GPIO45_UCX-SW1, GPIO46, GPIO47, GPIO48, GPIO49, GPIO50_Mikro-INT1, GPIO51-UCX-SW2, GPIO52-UCX-SW3, GPIO53_U14-CTS-CS, GPIO61-UCX-SW4, GPIO54_U14-CLK, GPIO21, GPIO63_RMII-RxERR, GPIO60_RMII-TxEN, GPIO62_RMII-CRSDV, GPIO59_RMII-TxD1, GPIO58_RMII-TxD0, GPIO23/RMII-RxD1XTAL32K_OUT, GPIO22/RMII-RxD0/XTAL32K_IN, GPIO55_U14-RTS_RMII-INT, PDn, GPIO56_U14-TxD-MISO-SCL-WS_RMII-MDC, GPIO57_U14-RxD-MOSI-SDA-TRX_RMII-MDIO
PHY_PIN HEADERS: GPIO22, GPIO23, GPIO25_U3-CLK, GPIO55_U14-RTS, GPIO56_U14-TxD-MISO-SCL-WS, GPIO57_U14-RxD-MOSI-SDA-TRX, GPIO58, GPIO59, GPIO60, GPIO62, GPIO63

### Nets
GND: C73.2 C74.2
GPIO11_U3-DTR: port GPIO-RIGHT.GPIO11_U3-DTR, port FC3.GPIO11_U3-DTR
GPIO12_U3-DSR: port GPIO-RIGHT.GPIO12_U3-DSR, port FC3.GPIO12_U3-DSR
GPIO13_U2-RxD-MOSI-SDA-RX: port GPIO-RIGHT.GPIO13_U2-RxD-MOSI-SDA-RX, port FC2.GPIO13_U2-RxD-MOSI-SDA-RX
GPIO14_U2-TxD-MISO-SCL-WS: port GPIO-RIGHT.GPIO14_U2-TxD-MISO-SCL-WS, port FC2.GPIO14_U2-TxD-MISO-SCL-WS
GPIO15_SOURCE: J55.2 ; port GPIO15  [project net GPIO15]
GPIO15_U2-CLK: J55.1 ; port FC2.GPIO15_U2-CLK
GPIO16_SOURCE: J56.2 ; port GPIO16  [project net GPIO16]
GPIO17_SOURCE: J57.2 ; port GPIO17  [project net GPIO17]
GPIO18__Mikro-INT0: J60.1 ; port Mikro-INT0, port GPIO-RIGHT.GPIO18_SDIO-D2_Mikro-INT0
GPIO18_SDIO-D2: J60.3 ; port SDIO.GPIO18_SDIO-D2
GPIO18_SOURCE: J60.2 ; port GPIO18  [project net GPIO18]
GPIO19_U3-RTS: J58.1 ; port FC3.GPIO19_U3-RTS
GPIO19_U3-RTS_SDIO-D0: J58.2 ; port GPIO-RIGHT.GPIO19_U3-RTS_SDIO-D0
GPIO20_U3-CTS-CS: J59.1 ; port FC3.GPIO20_U3-CTS-CS
GPIO20_U3-CTS-CS_SDIO-D1: J59.2 ; port GPIO-RIGHT.GPIO20_U3-CTS-CS_SDIO-D1
GPIO22: R273.1 ; port PHY_PIN.GPIO22
GPIO22/RMII-RxD0/XTAL32K_IN: R271.2 R272.2 R273.2 ; port GPIO-LEFT.GPIO22/RMII-RxD0/XTAL32K_IN
GPIO23: R269.1 ; port PHY_PIN.GPIO23
GPIO23/RMII-RxD1XTAL32K_OUT: R267.2 R268.2 R269.2 ; port GPIO-LEFT.GPIO23/RMII-RxD1XTAL32K_OUT
GPIO24_U3-RxD-MOSI-SDA-TRX: port GPIO-RIGHT.GPIO24_U3-RxD-MOSI-SDA-TRX, port FC3.GPIO24_U3-RxD-MOSI-SDA-TRX
GPIO25_U3-CLK: R282.1 ; port FC3.GPIO25_U3-CLK, port PHY_PIN.GPIO25_U3-CLK
GPIO25_U3-CLK_RMII-RFECLK: R279.2 R282.2 ; port GPIO-RIGHT.GPIO25_U3-CLK_RMII-RFECLK
GPIO26-U3-TxD-MISO-SCL-WS: port GPIO-RIGHT.GPIO26-U3-TxD-MISO-SCL-WS, port FC3.GPIO26-U3-TxD-MOSI-SCL-WS
GPIO53_U14-CTS-CS: port FC14.GPIO53_U14-CTS-CS, port GPIO-LEFT.GPIO53_U14-CTS-CS
GPIO54_U14-CLK: port FC14.GPIO54_U14-CLK, port GPIO-LEFT.GPIO54_U14-CLK
GPIO55_U14-RTS: R115.1 ; port FC14.GPIO55_U14-RTS, port PHY_PIN.GPIO55_U14-RTS
GPIO55_U14-RTS_RMII-INT: R111.2 R115.2 ; port GPIO-LEFT.GPIO55_U14-RTS_RMII-INT
GPIO56_U14-TxD-MISO-SCL-WS: R264.1 ; port FC14.GPIO56_U14-TxD-MISO-SCL-WS, port PHY_PIN.GPIO56_U14-TxD-MISO-SCL-WS
GPIO56_U14-TxD-MISO-SCL-WS_RMII-MDC: R263.2 R264.2 ; port GPIO-LEFT.GPIO56_U14-TxD-MISO-SCL-WS_RMII-MDC
GPIO57_U14-RxD-MOSI-SDA-TRX: R266.1 ; port FC14.GPIO57_U14-RxD-MOSI-SDA-TRX, port PHY_PIN.GPIO57_U14-RxD-MOSI-SDA-TRX
GPIO57_U14-RxD-MOSI-SDA-TRX_RMII-MDIO: R265.2 R266.2 ; port GPIO-LEFT.GPIO57_U14-RxD-MOSI-SDA-TRX_RMII-MDIO
GPIO58: R277.1 ; port PHY_PIN.GPIO58
GPIO58_RMII-TxD0: R275.2 R277.2 ; port GPIO-LEFT.GPIO58_RMII-TxD0
GPIO59: R278.1 ; port PHY_PIN.GPIO59
GPIO59_RMII-TxD1: R276.2 R278.2 ; port GPIO-LEFT.GPIO59_RMII-TxD1
GPIO60: R283.1 ; port PHY_PIN.GPIO60
GPIO60_RMII-TxEN: R280.2 R283.2 ; port GPIO-LEFT.GPIO60_RMII-TxEN
GPIO62: R284.1 ; port PHY_PIN.GPIO62
GPIO62_RMII-CRSDV: R281.2 R284.2 ; port GPIO-LEFT.GPIO62_RMII-CRSDV
GPIO63: R286.1 ; port PHY_PIN.GPIO63
GPIO63_RMII-RxERR: R285.2 R286.2 ; port GPIO-LEFT.GPIO63_RMII-RxERR
PHY_RESET: port PHY_RESET, port PHY.PHY_RESET
RMII-CRSDV: R281.1 ; port PHY.GPIO62_RMII-CRSDV  [project net CRSDV]
RMII-INT: R111.1 ; port PHY.RMII-INT  [project net INT]
RMII-MDC: R263.1 ; port PHY.RMII-MDC  [project net MDC]
RMII-MDIO: R265.1 ; port PHY.RMII-MDIO  [project net MDIO]
RMII-RFECLK: R279.1 ; port PHY.RMII-RFECLK  [project net RFECLK]
RMII-RxD0: R272.1 ; port PHY.RMII-RxD0
RMII-RxD1: R268.1 ; port PHY.RMII-RxD1
RMII-RxERR: R285.1 ; port PHY.GPIO63_RMII-RxERR
RMII-TxD0: R275.1 ; port PHY.GPIO58_RMII-TxD0
RMII-TxD1: R276.1 ; port PHY.GPIO59_RMII-TxD1
RMII-TxEN: R280.1 ; port PHY.GPIO60_RMII-TxEN
SDIO-CLK: J55.3 ; port SDIO.GPIO15_SDIO-CLK
SDIO-CMD: J57.3 ; port SDIO.SDIO-CMD
SDIO-D0: J58.3 ; port SDIO.SDIO-D0
SDIO-D1: J59.3 ; port SDIO.SDIO-D1
SDIO-D3: J56.3 ; port SDIO.SDIO-D3
XTAL32K_IN: C74.1 R271.1 X1.1
XTAL32K_OUT: C73.1 R267.1 X1.2
NetJ56_1: J56.1 ; port GPIO16_ML_MUX
NetJ57_1: J57.1 ; port GPIO17_ML_MUX

### Notes on the sheet
- (near R115) Defult RMII VS FC14 option
- (near R269) Defult RMII VS 32kHZ option
- FC-135 32.7680KA-AG0
- 32kHz External Crystal
- Defult RMII VS FC3 Clk option
- (near J55) Defult FC2, FC3 VS SDIO option
- From power
- To MCULINK-MUX
- (near J59) Defult MikroBus INT VS SDIO option
- Revision:
- Page:

### Library data of the parts
C73 C74 = UBXH01-0004017: CAP CER C0G 0402 18P 5% 25V; Manufacturer: Murata Manufacturing Company, Ltd.; Manufacturer P/N: GRM1555C1H180JA01; Editor: doris.zahnd; Released by: daniel.hurni; Env: ROHS; Permitted Use: Volume Products; Perferred: PREF; Mfg P/N Status: NRND; Mfg P/N Split: 100; Mfg P/N Released: Yes; Part Number: UBXH01-0004017; Tolerance: 5%; Max Voltage: 25V; Min Operating Temp: -55°C; Max Operating Temp: 125°C; Part Type: Capacitor; Release Data: 2009-12-03T17:48:42; UBX Wiki: https://wiki.u-blox.com/bin/view/Operations/PartDetails?index=5178; RefDes: C; Manufacturer 2: Murata Manufacturing Company, Ltd.; Manufacturer P/N 2: GRM1555C1E180JZ01; Mfg P/N Status 2: Obsolete; Mfg P/N Split 2: 0; Mfg P/N Released 2: Yes; Manufacturer 3: Murata Manufacturing Company, Ltd.; Manufacturer P/N 3: GRM1555C1H180JZ01; Mfg P/N Status 3: Obsolete; Mfg P/N Split 3: 0; Mfg P/N Released 3: Yes
J55-J60 = Solderbridge-Option: Added By: Paul B; Part Number: Solderbridge-Option; Height: 0; DNP: DNP; Added Date: 12/3/2015
R111 R263 R265 R267 R268 R271 R272 R275 R276 R279-R281 R285 = UBXH18-0003002: RES THICK FILM CHIP 0402 0R 0 100mW; Manufacturer: KOA; Manufacturer P/N: RK73Z1ETTD; Tolerance: 0; Editor: charlotte.biber; Released by: peter.mueller; Env: ROHS; Permitted Use: Volume Products; Perferred: PREF; Mfg P/N Status: NRND; Mfg P/N Split: 100; Mfg P/N Released: Yes; Part Number: UBXH18-0003002; Manufacturer 2: YAGEO; Max Power: 100mW; Part Type: Resistor; Release Data: 2012-06-05T09:49:55; UBX Wiki: https://wiki.u-blox.com/bin/view/Operations/PartDetails?index=6611; RefDes: R; Manufacturer P/N 2: 2322_705_91001_L; Mfg P/N Status 2: NRND; Mfg P/N Split 2: 0; Mfg P/N Released 2: Yes
R115 R264 R266 R269 R273 R277 R278 R282-R284 R286 = UBXH18-0003001: RES THICK FILM CHIP 0603 0R 0 100mW; Manufacturer: YAGEO; Manufacturer P/N: RC0603JR-070RL; Tolerance: 0; Editor: martin.frauchiger; Env: ROHS; Permitted Use: Volume Products; Perferred: PREF; Mfg P/N Status: Active; Mfg P/N Split: 100; Mfg P/N Released: Yes; Part Number: UBXH18-0003001; Max Power: 100mW; Part Type: Resistor; Released by: martin.frauchiger; Release Data: 2005-07-14T10:55:51; UBX Wiki: https://wiki.u-blox.com/bin/view/Operations/PartDetails?index=6609; RefDes: R
X1 = 100-00005: XTAL, 2Pin, 32.768kHz, 7pF 20ppm; Part Name: XTAL 32.768kHz 7pF 20ppm 3215; Manufacturer 1: AVX Corporation; Manufacturer Part Number 1: ST3215SB32768C0HPWBB; Body Size: 3.2mm x 1.5mm; MFG Package: 2-SMD; Use in new designs: Yes; UBX Code: None; Item Phase: In Production; Manufacturer P/N: *; Part Number: 100-00005; Revision: 0C; Supplier 1: Digi-Key; Supplier Part Number 1: 1253-1113-1-ND; Manufacturer 2: Epson; Supplier 2: Digi-Key; Supplier Part Number 2: SER4086CT-ND; Height: 0.9mm; Pins: 2; Max Operating Temp: 85; Voltage: None; Manufacturer Part Number 2: FC-135 32.7680KA-AG3; Min Operating Temp: -40

## Sheet EVK-IRIS-W1-FTDI.SchDoc
size A3; DocumentNumber: 9; SheetNumber: 9; SheetTotal: 14
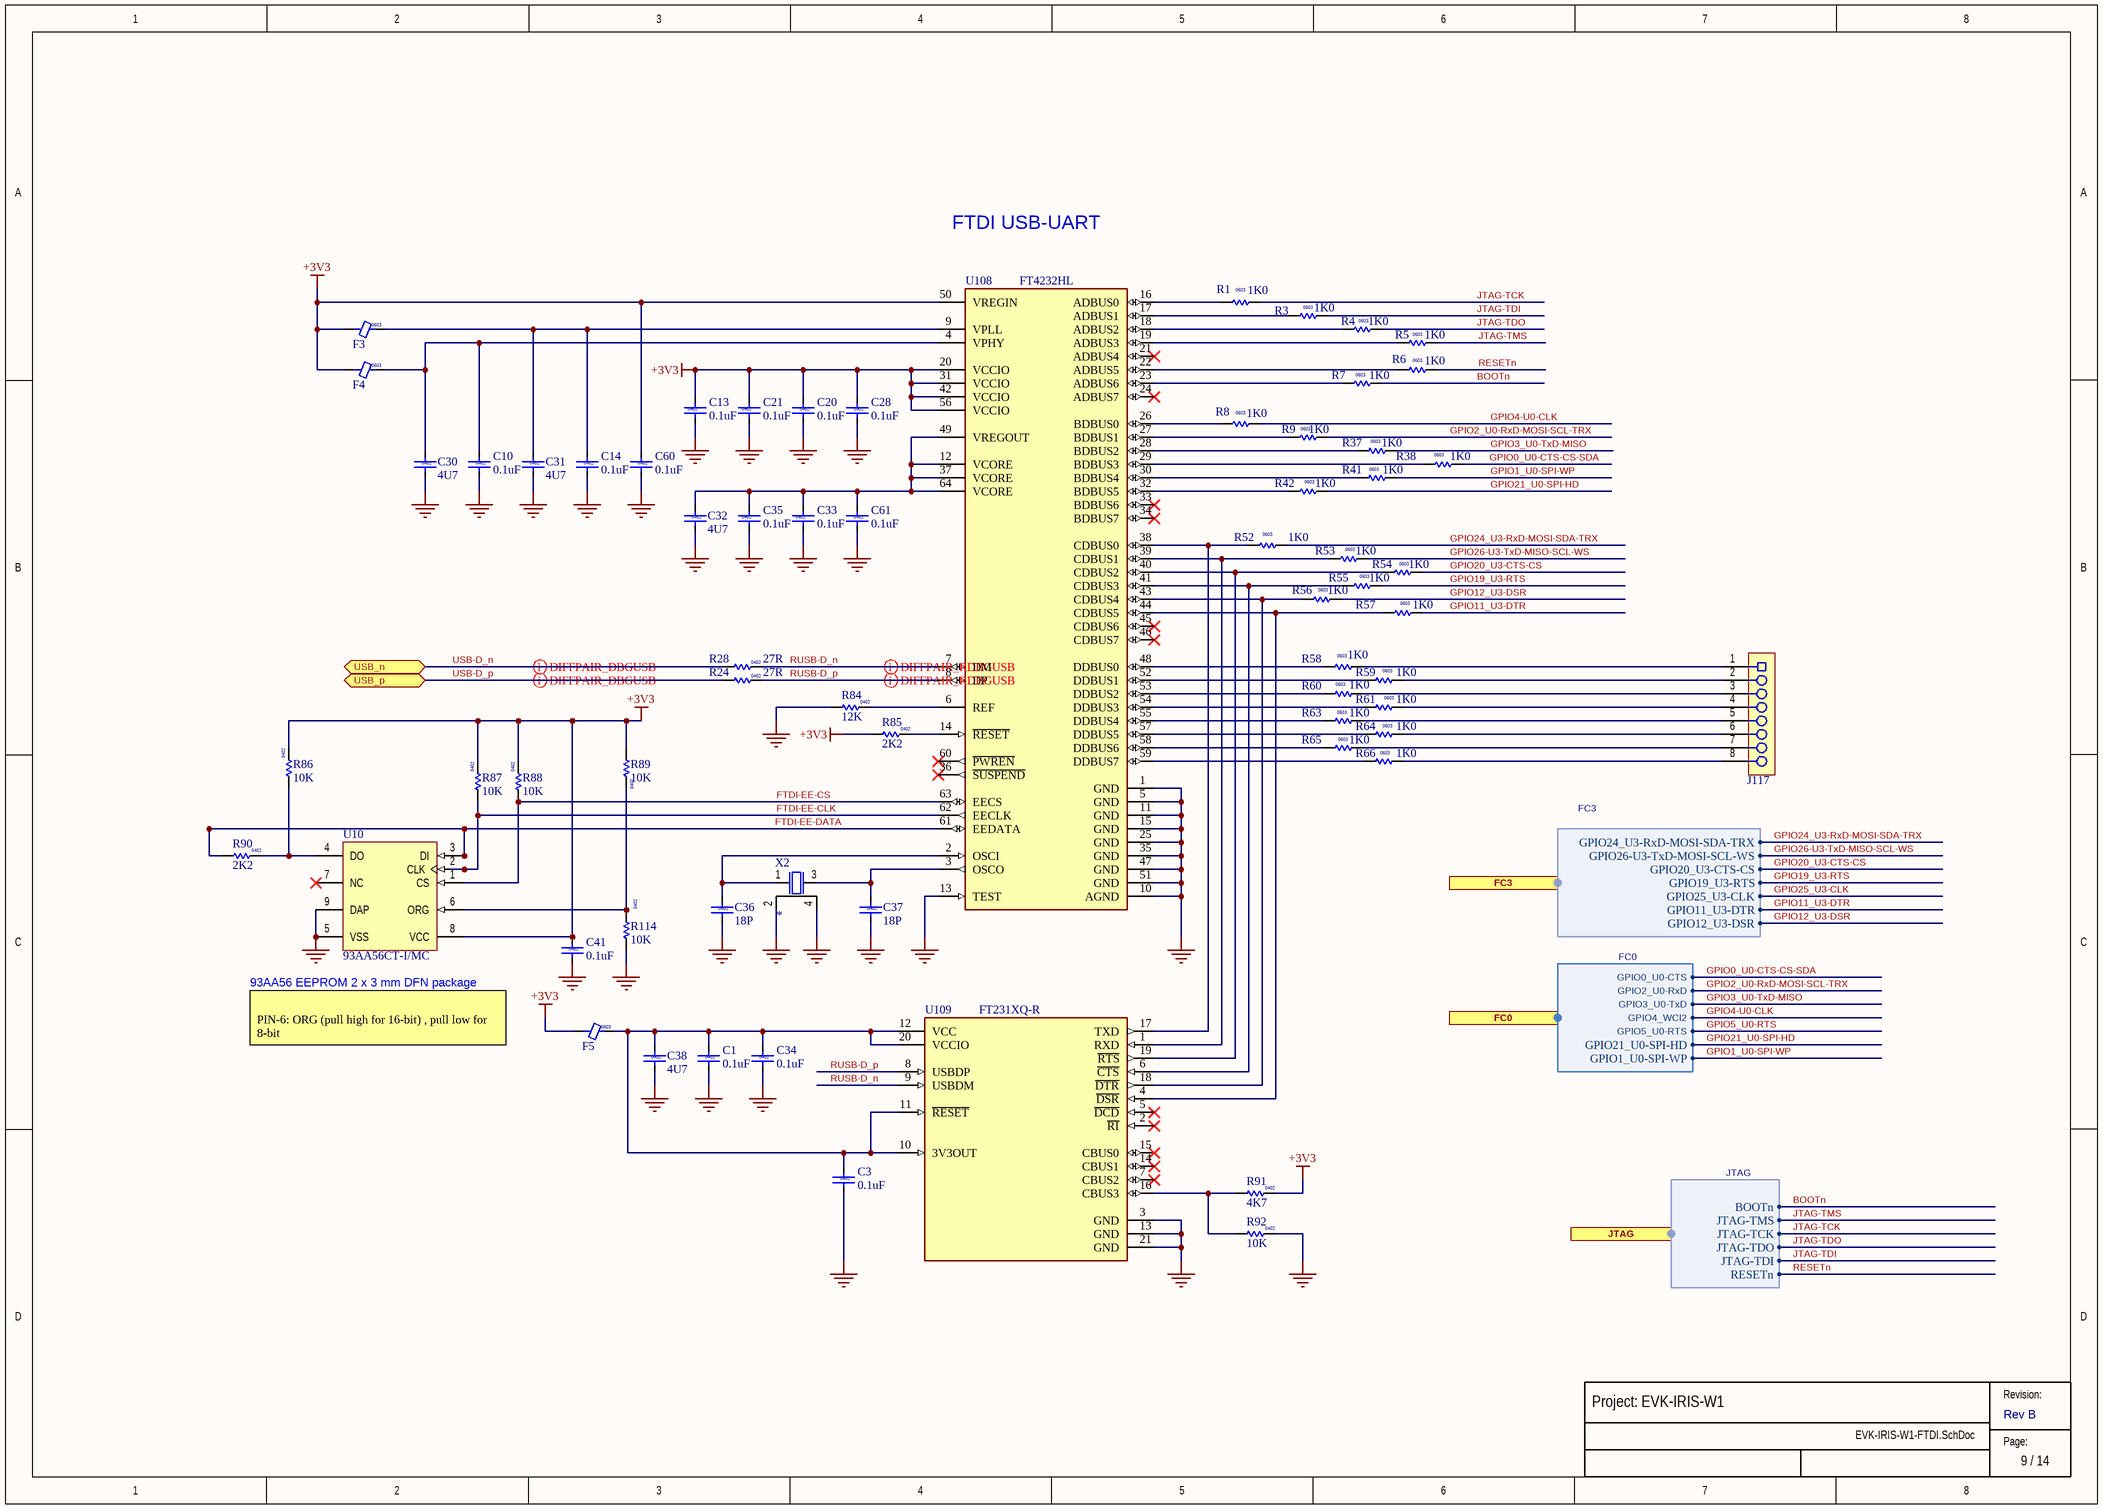
[diagram p3: EVK-IRIS-W1-FTDI.SchDoc]

### Parts
C1  value 0.1uF  Size: 0402  [Cap 0402 HD]
C3  value 0.1uF  Size: 0402  [Cap 0402 HD]
C10  value 0.1uF  Size: 0402  [Cap 0402 HD]
C13  value 0.1uF  Size: 0402  [Cap 0402 HD]
C14  value 0.1uF  Size: 0402  [Cap 0402 HD]
C20  value 0.1uF  Size: 0402  [Cap 0402 HD]
C21  value 0.1uF  Size: 0402  [Cap 0402 HD]
C28  value 0.1uF  Size: 0402  [Cap 0402 HD]
C30  value 4U7  Size: 0402  [Cap 0402 HD]
C31  value 4U7  Size: 0402  [Cap 0402 HD]
C32  value 4U7  Size: 0402  [Cap 0402 HD]
C33  value 0.1uF  Size: 0402  [Cap 0402 HD]
C34  value 0.1uF  Size: 0402  [Cap 0402 HD]
C35  value 0.1uF  Size: 0402  [Cap 0402 HD]
C36  value 18P  Size: 0402  [Cap 0402]
C37  value 18P  Size: 0402  [Cap 0402]
C38  value 4U7  Size: 0402  [Cap 0402 HD]
C41  value 0.1uF  Size: 0402  [Cap 0402 HD]
C60  value 0.1uF  Size: 0402  [Cap 0402 HD]
C61  value 0.1uF  Size: 0402  [Cap 0402 HD]
F3  Size: 0603  [IND 0603 HD]
F4  Size: 0603  [IND 0603 HD]
F5  Size: 0603  [IND 0603 HD]
J117  (no value)  [SKT-0.1P-SSM-108-L-SV]
R1  value 1K0  Size: 0603  [RES 0603 HD]
R3  value 1K0  Size: 0603  [RES 0603 HD]
R4  value 1K0  Size: 0603  [RES 0603 HD]
R5  value 1K0  Size: 0603  [RES 0603 HD]
R6  value 1K0  Size: 0603  [RES 0603 HD]
R7  value 1K0  Size: 0603  [RES 0603 HD]
R8  value 1K0  Size: 0603  [RES 0603 HD]
R9  value 1K0  Size: 0603  [RES 0603 HD]
R24  value 27R  Size: 0402  [RES 0402 HD]
R28  value 27R  Size: 0402  [RES 0402 HD]
R37  value 1K0  Size: 0603  [RES 0603 HD]
R38  value 1K0  Size: 0603  [RES 0603 HD]
R41  value 1K0  Size: 0603  [RES 0603 HD]
R42  value 1K0  Size: 0603  [RES 0603 HD]
R52  value 1K0  Size: 0603  [RES 0603 HD]
R53  value 1K0  Size: 0603  [RES 0603 HD]
R54  value 1K0  Size: 0603  [RES 0603 HD]
R55  value 1K0  Size: 0603  [RES 0603 HD]
R56  value 1K0  Size: 0603  [RES 0603 HD]
R57  value 1K0  Size: 0603  [RES 0603 HD]
R58  value 1K0  Size: 0603  [RES 0603 HD]
R59  value 1K0  Size: 0603  [RES 0603 HD]
R60  value 1K0  Size: 0603  [RES 0603 HD]
R61  value 1K0  Size: 0603  [RES 0603 HD]
R63  value 1K0  Size: 0603  [RES 0603 HD]
R64  value 1K0  Size: 0603  [RES 0603 HD]
R65  value 1K0  Size: 0603  [RES 0603 HD]
R66  value 1K0  Size: 0603  [RES 0603 HD]
R84  value 12K  Size: 0402  [RES 0402 HD]
R85  value 2K2  Size: 0402  [RES 0402 HD]
R86  value 10K  Size: 0402  [RES 0402 HD]
R87  value 10K  Size: 0402  [RES 0402 HD]
R88  value 10K  Size: 0402  [RES 0402 HD]
R89  value 10K  Size: 0402  [RES 0402 HD]
R90  value 2K2  Size: 0402  [RES 0402 HD]
R91  value 4K7  Size: 0402  [RES 0402 HD]
R92  value 10K  Size: 0402  [RES 0402 HD]
R114  value 10K  Size: 0402  [RES 0402 HD]
U10  93AA56CT-I/MC  [DFN-MC8]
U108  FT4232HL  [QFP0.5P16x16-64Pin_HD]
U109  FT231XQ-R  [QFN_5x5_FT231XQ]
X2  (no value)  [XTAL_3225]

### Ports
FC0 (harness FC0), FC3 (harness FC3), JTAG (harness JTAG), USB_n (bidir), USB_p (bidir)

### Harnesses
JTAG: JTAG-TCK, JTAG-TDI, JTAG-TDO, JTAG-TMS, RESETn, BOOTn
FC3: GPIO20_U3-CTS-CS, GPIO19_U3-RTS, GPIO24_U3-RxD-MOSI-SDA-TRX, GPIO26-U3-TxD-MOSI-SCL-WS, GPIO25_U3-CLK, GPIO11_U3-DTR, GPIO12_U3-DSR
FC0: GPIO0_U0-CTS, GPIO2_U0-RxD, GPIO3_U0-TxD, GPIO5_U0-RTS, GPIO4_WCI2, GPIO21_U0-SPI-HD, GPIO1_U0-SPI-WP

### Nets
+3V3: C13.1 C20.1 C21.1 C28.1 C41.1 C60.1 F3.1 F4.1 F5.1 R85.1 R86.2 R87.2 R88.2 R89.1 R91.2 U10.8(VCC) U108.20(VCCIO) U108.31(VCCIO) U108.42(VCCIO) U108.50(VREGIN) U108.56(VCCIO)
GND: C1.2 C3.2 C10.2 C13.2 C14.2 C20.2 C21.2 C28.2 C30.2 C31.2 C32.2 C33.2 C34.2 C35.2 C36.2 C37.2 C38.2 C41.2 C60.2 C61.2 R84.1 R92.2 R114.1 U10.5(VSS) U10.9(DAP) U108.1(GND) U108.5(GND) U108.10(AGND) U108.11(GND) U108.13(TEST) U108.15(GND) U108.25(GND) U108.35(GND) U108.47(GND) U108.51(GND) U109.3(GND) U109.13(GND) U109.21(GND) X2.2 X2.4
BOOTn: R7.2 ; port JTAG.BOOTn
FTDI-EE-CLK: R87.1 U10.2(CLK) U108.62(EECLK)
FTDI-EE-CS: R88.1 U10.1(CS) U108.63(EECS)
FTDI-EE-DATA: R90.1 U10.3(DI) U108.61(EEDATA)
GPIO0_U0-CTS-CS-SDA: R38.2 ; port FC0.GPIO0_U0-CTS
GPIO1_U0-SPI-WP: R41.2 ; port FC0.GPIO1_U0-SPI-WP
GPIO2_U0-RxD-MOSI-SCL-TRX: R9.2 ; port FC0.GPIO2_U0-RxD
GPIO3_U0-TxD-MISO: R37.2 ; port FC0.GPIO3_U0-TxD
GPIO4-U0-CLK: R8.2 ; port FC0.GPIO4_WCI2
GPIO11_U3-DTR: R57.2 ; port FC3.GPIO11_U3-DTR
GPIO12_U3-DSR: R56.2 ; port FC3.GPIO12_U3-DSR
GPIO19_U3-RTS: R55.2 ; port FC3.GPIO19_U3-RTS
GPIO20_U3-CTS-CS: R54.2 ; port FC3.GPIO20_U3-CTS-CS
GPIO21_U0-SPI-HD: R42.2 ; port FC0.GPIO21_U0-SPI-HD
GPIO24_U3-RxD-MOSI-SDA-TRX: R52.2 ; port FC3.GPIO24_U3-RxD-MOSI-SDA-TRX
GPIO26-U3-TxD-MISO-SCL-WS: R53.2 ; port FC3.GPIO26-U3-TxD-MOSI-SCL-WS
JTAG-TCK: R1.2 ; port JTAG.JTAG-TCK
JTAG-TDI: R3.2 ; port JTAG.JTAG-TDI
JTAG-TDO: R4.2 ; port JTAG.JTAG-TDO
JTAG-TMS: R5.2 ; port JTAG.JTAG-TMS
RESETn: R6.2 ; port JTAG.RESETn
RUSB-D_n: R28.1 U108.7(DM) U109.9(USBDM)
RUSB-D_p: R24.1 U108.8(DP) U109.8(USBDP)
USB-D_n: R28.2 ; port USB_n
USB-D_p: R24.2 ; port USB_p
NetC1_1: C1.1 C3.1 C34.1 C38.1 F5.2 U109.10(3V3OUT) U109.11(~{RESET}) U109.12(VCC) U109.20(VCCIO)
NetC10_1: C10.1 C30.1 F4.2 U108.4(VPHY)
NetC14_1: C14.1 C31.1 F3.2 U108.9(VPLL)
NetC32_1: C32.1 C33.1 C35.1 C61.1 U108.12(VCORE) U108.37(VCORE) U108.49(VREGOUT) U108.64(VCORE)
NetC36_1: C36.1 U108.2(OSCI) X2.1
NetC37_1: C37.1 U108.3(OSCO) X2.3
NetJ117_1: J117.1 R58.2
NetJ117_2: J117.2 R59.2
NetJ117_3: J117.3 R60.2
NetJ117_4: J117.4 R61.2
NetJ117_5: J117.5 R63.2
NetJ117_6: J117.6 R64.2
NetJ117_7: J117.7 R65.2
NetJ117_8: J117.8 R66.2
NetR1_1: R1.1 U108.16(ADBUS0)
NetR3_1: R3.1 U108.17(ADBUS1)
NetR4_1: R4.1 U108.18(ADBUS2)
NetR5_1: R5.1 U108.19(ADBUS3)
NetR6_1: R6.1 U108.22(ADBUS5)
NetR7_1: R7.1 U108.23(ADBUS6)
NetR8_1: R8.1 U108.26(BDBUS0)
NetR9_1: R9.1 U108.27(BDBUS1)
NetR37_1: R37.1 U108.28(BDBUS2)
NetR38_1: R38.1 U108.29(BDBUS3)
NetR41_1: R41.1 U108.30(BDBUS4)
NetR42_1: R42.1 U108.32(BDBUS5)
NetR52_1: R52.1 U108.38(CDBUS0) U109.17(TXD)
NetR53_1: R53.1 U108.39(CDBUS1) U109.1(RXD)
NetR54_1: R54.1 U108.40(CDBUS2) U109.19(~{RTS})
NetR55_1: R55.1 U108.41(CDBUS3) U109.6(~{CTS})
NetR56_1: R56.1 U108.43(CDBUS4) U109.18(~{DTR})
NetR57_1: R57.1 U108.44(CDBUS5) U109.4(~{DSR})
NetR58_1: R58.1 U108.48(DDBUS0)
NetR59_1: R59.1 U108.52(DDBUS1)
NetR60_1: R60.1 U108.53(DDBUS2)
NetR61_1: R61.1 U108.54(DDBUS3)
NetR63_1: R63.1 U108.55(DDBUS4)
NetR64_1: R64.1 U108.57(DDBUS5)
NetR65_1: R65.1 U108.58(DDBUS6)
NetR66_1: R66.1 U108.59(DDBUS7)
NetR84_2: R84.2 U108.6(REF)
NetR85_2: R85.2 U108.14(~{RESET})
NetR86_1: R86.1 R90.2 U10.4(DO)
NetR89_2: R89.2 R114.2 U10.6(ORG)
NetR91_1: R91.1 R92.1 U109.16(CBUS3)

Not connected (* = marked no-connect by the designer): U10 7(NC)*; U108 21(ADBUS4)* 24(ADBUS7)* 33(BDBUS6)* 34(BDBUS7)* 36(~{SUSPEND})* 45(CDBUS6)* 46(CDBUS7)* 60(~{PWREN})*; U109 2(~{RI})* 5(~{DCD})* 7(CBUS2)* 14(CBUS1)* 15(CBUS0)*

### Layout directives
differential pair; differential pair class USB_DIFF; net class USB_DIFF: RUSB-D_n, RUSB-D_p, USB-D_p
differential pair; net class USB_DIFF; differential pair class USB_DIFF: USB-D_n

### Notes on the sheet
- FTDI USB-UART
- (near U10) 93AA56 EEPROM 2 x 3 mm DFN package
- PIN-6: ORG (pull high for 16-bit) , pull low for 8-bit
- Revision:
- Page:

### Library data of the parts
C1 C3 C10 C13 C14 C20 C21 C28 C33-C35 C41 C60 C61 = 120-00016: Cap, Ceramic 0.1uF 10V 10% X5R 0402; Part Name: CAP CER 0.1UF 10V 10% X5R 0402; Manufacturer 1: Murata Electronics North America; Manufacturer Part Number 1: GRM155R61A104KA01J; Tolerance: +/- 10%; Use in new designs: Yes; UBX Code: None; Item Phase: In Production; Part Number: 120-00016; Revision: 0A; Supplier 1: Digi-Key; Supplier Part Number 1: 490-6297-1-ND; Manufacturer 2: Yageo; Supplier 2: Digi-Key; Supplier Part Number 2: 311-1336-1-ND; Height: 0.55mm; Pins: 2; Temperature Coefficient: X5R; Voltage: 10V; Max Operating Temp: 85; Manufacturer Part Number 2: CC0402KRX5R6BB104; Min Operating Temp: -55
C30-C32 C38 = UBXH01-0000243: CAP CER X5R 0402 4U7 20% 10V; Manufacturer: Murata Manufacturing Company, Ltd.; Manufacturer P/N: GRM155R61A475MEAA; Editor: martin.pilik; Released by: fabrice.bret-dibat; Env: GREEN; Permitted Use: Volume Products; Perferred: PREF; Mfg P/N Status: Active; Mfg P/N Split: 100; Mfg P/N Released: Yes; Part Number: UBXH01-0000243; Tolerance: 20%; Max Voltage: 10V; Min Operating Temp: -40°C; Max Operating Temp: 85°C; Part Type: Capacitor; Release Data: 2021-05-10T12:57:47; UBX Wiki: https://wiki.u-blox.com/bin/view/Operations/PartDetails?index=24303; RefDes: C; Mfg P/N Datasheet: https://wiki.u-blox.com/bin/view/Generic/Docs/DocumentSummary?index=24302
C36 C37 = UBXH01-0004017: as C73 on sheet EVK-IRIS-W1-FC2_FC3_FC14_RMII; Part Number: UBXH01-0004017; Tolerance: 5%; Max Voltage: 25V; Min Operating Temp: -55°C; Max Operating Temp: 125°C; Part Type: Capacitor; Release Data: 2009-12-03T17:48:42; UBX Wiki: https://wiki.u-blox.com/bin/view/Operations/PartDetails?index=5178; RefDes: C; Manufacturer 2: Murata Manufacturing Company, Ltd.; Manufacturer P/N 2: GRM1555C1E180JZ01; Mfg P/N Status 2: Obsolete; Mfg P/N Split 2: 0; Mfg P/N Released 2: Yes; Manufacturer 3: Murata Manufacturing Company, Ltd.; Manufacturer P/N 3: GRM1555C1H180JZ01; Mfg P/N Status 3: Obsolete; Mfg P/N Split 3: 0; Mfg P/N Released 3: Yes
F3-F5 = UBXH08-0000001: FERRITE BEAD 0603 600 OHM AT 100MHZ 600OHM 500mA; Manufacturer: TDK Corporation; Manufacturer P/N: MMZ1608B601C; Editor: daniel.hurni; Released by: martin.frauchiger; Env: ROHS; Permitted Use: Support Products; Perferred: PREF; Mfg P/N Status: Active; Mfg P/N Split: 100; Mfg P/N Released: Yes; Part Number: UBXH08-0000001; Value: 600OHM; Max Current: 500mA; Min Operating Temp: -40°C; Max Operating Temp: 125°C; Part Type: Ferrite; Release Data: 2009-12-02T10:18:36; UBX Wiki: https://wiki.u-blox.com/bin/view/Operations/PartDetails?index=7960; RefDes: FB; Mfg P/N Datasheet: https://wiki.u-blox.com/bin/view/Generic/Docs/DocumentSummary?index=7941
J117 = 130-00102: Socket Strip 0.1" 8 Pin 1Row SMD Black; Manufacturer 1: Samtec; Manufacturer Part Number 1: SSM-108-F-SV-P-TR; Part Name: CON SKT Strip 0.1" 8Pin 1Row SMD Black; Item Phase: In Production; Use in new designs: Yes; Voltage: 572VDC; UBX Code: None; Part Number: 130-00102; Supplier 1: Avnet; Supplier Part Number 1: SSM-108-F-SV-P-TR; Diameter: None; Height: 7.37mm; Max Operating Temp: 105; Min Operating Temp: -55; Pins: 8; Revision: 0D; Manufacturer 2: Sullins Connector Solutions; Manufacturer Part Number 2: NPPC081KFXC-RC; Supplier 2: Digi-Key; Supplier Part Number 2: S5639-ND
R1 R3-R9 R37 R38 R41 R42 R52-R61 R63-R66 = UBXH18-0000400: RES THICK FILM CHIP 0603 25PPM 1K0 0.1% 100mW; Manufacturer: YAGEO; Manufacturer P/N: RT0603BRD071KL; Editor: martin.kessel; Env: ROHS; Permitted Use: Internal Use; Perferred: PREF; Mfg P/N Status: Active; Mfg P/N Split: 100; Mfg P/N Released: No; Part Number: UBXH18-0000400; Tolerance: 0.1%; Max Power: 100mW; Part Type: Resistor; UBX Wiki: https://wiki.u-blox.com/bin/view/Operations/PartDetails?index=27323; RefDes: R; Min Operating Temp: -55°C; Max Operating Temp: 155°C
R24 R28 = 180-00125: Resistor, 27ohm, 1%, 1/16W, 0402; Part Name: RES SMD 27 OHM 1% 1/16W 0402; Manufacturer 1: Panasonic Electronic Components; Manufacturer Part Number 1: ERJ-2RKF27R0X; Tolerance: +/- 1%; Use in new designs: Yes; UBX Code: None; Item Phase: In Production; Part Number: 180-00125; Supplier 1: Digi-Key; Supplier Part Number 1: P27.0LCT-ND; Height: 0.4mm; Pins: 2; Power: 1/16W; Revision: 0C; Manufacturer 2: Yageo; Supplier 2: Digi-Key; Supplier Part Number 2: YAG3086CT-ND; Max Operating Temp: 155; Voltage: None; Manufacturer Part Number 2: RC0402FR-0727RL; Min Operating Temp: -55
R84 = UBXH18-0000137: RES THICK FILM CHIP 0402 12K 1% 63mW; Manufacturer: Vishay; Manufacturer P/N: CRCW040212K0FKED; Editor: matej.budin; Released by: gabriele.capello; Env: ROHS; Permitted Use: Support Products; Perferred: PREF; Mfg P/N Status: Active; Mfg P/N Split: 100; Mfg P/N Released: Yes; Part Number: UBXH18-0000137; Tolerance: 1%; Max Power: 63mW; Min Operating Temp: -55°C; Max Operating Temp: 125°C; Part Type: Resistor; Release Data: 2014-08-26T10:20:00; UBX Wiki: https://wiki.u-blox.com/bin/view/Operations/PartDetails?index=21075; RefDes: R; Mfg P/N Datasheet: https://wiki.u-blox.com/bin/view/Generic/Docs/DocumentSummary?index=21077
R85 R90 = UBXH18-0008057: RES THICK FILM CHIP 0402 2K2 5% 100mW; Manufacturer: YAGEO; Manufacturer P/N: 2322_705_87222_L; Editor: roland.rust; Env: ROHS; Permitted Use: Volume Products; Perferred: PREF; Mfg P/N Status: NRND; Mfg P/N Split: 100; Mfg P/N Released: Yes; Part Number: UBXH18-0008057; Tolerance: 5%; Max Power: 100mW; Part Type: Resistor; Released by: roland.rust; Release Data: 2007-02-09T10:46:57; UBX Wiki: https://wiki.u-blox.com/bin/view/Operations/PartDetails?index=6956; RefDes: R; Manufacturer 2: YAGEO; Manufacturer P/N 2: RC0402JR-072K2L; Mfg P/N Status 2: Active; Mfg P/N Split 2: 0; Mfg P/N Released 2: Yes; Mfg P/N Datasheet 2: https://wiki.u-blox.com/bin/view/Generic/Docs/DocumentSummary?index=8163
R86-R89 R92 R114 = UBXH18-0008073: RES THICK FILM CHIP 0402 10K 5% 100mW; Manufacturer: KOA; Manufacturer P/N: RK73B1ETTD103J; Editor: martin.frauchiger; Env: ROHS; Permitted Use: Volume Products; Perferred: PREF; Mfg P/N Status: NRND; Mfg P/N Split: 100; Mfg P/N Released: Yes; Part Number: UBXH18-0008073; Tolerance: 5%; Max Power: 100mW; Part Type: Resistor; Released by: martin.frauchiger; Release Data: 2005-08-19T10:42:45; UBX Wiki: https://wiki.u-blox.com/bin/view/Operations/PartDetails?index=6981; RefDes: R; Manufacturer 2: YAGEO; Manufacturer P/N 2: RC0402JR-0710KL; Mfg P/N Status 2: Active; Mfg P/N Split 2: 0; Mfg P/N Released 2: No; Manufacturer 3: YAGEO; Manufacturer P/N 3: 2322_705_87103_L; Mfg P/N Status 3: NRND; Mfg P/N Split 3: 0; Mfg P/N Released 3: Yes
R91 = UBXH18-0008065: RES THICK FILM CHIP 0402 4K7 5% 100mW; Manufacturer: YAGEO; Manufacturer P/N: 2322_705_70472_L; Editor: martin.frauchiger; Env: ROHS; Permitted Use: Volume Products; Perferred: PREF; Mfg P/N Status: NRND; Mfg P/N Split: 100; Mfg P/N Released: Yes; Part Number: UBXH18-0008065; Tolerance: 5%; Max Power: 100mW; Part Type: Resistor; Released by: martin.frauchiger; Release Data: 2005-08-19T10:42:45; UBX Wiki: https://wiki.u-blox.com/bin/view/Operations/PartDetails?index=6969; RefDes: R; Manufacturer 2: KOA; Manufacturer P/N 2: RK73B1ETTD472J; Mfg P/N Status 2: NRND; Mfg P/N Split 2: 0; Mfg P/N Released 2: Yes
U10 = CMP-0162-00287-1: 2K, 256x8 or 128x16-bit, 1.8V Microwire Serial EEPROM, 8-Pin DFN, Industrial Temperature, Tape and Reel; Manufacturer: Microchip; PackageReference: DFN-MC8; PackageVersion: revBB, Aug-2009; DatasheetVersion: revF, May-2008; PackageDescription: 8-Lead Plastic Dual Flat, No Lead Package (MC) - 2x3x0.9mm Body [DFN]; Manufacturer P/N: 93AA56CT-I/MC; Part type: EEPROM IC
U108 = UBXH10-0000092: FTDI FT4232HL QUAD HIGH SPEED USB TO MULTIPURPOSE UART LQFP-64; Manufacturer: FTDI Future Technology Devices International; Editor: olof.viklund; Released by: aneeb.sohail; Env: ROHS; Permitted Use: Support Products; Perferred: PREF; Mfg P/N Status: Active; Mfg P/N Split: 100; Mfg P/N Released: No; Part Number: UBXH10-0000092; Value: FT4232HL; Min Operating Temp: -40°C; Max Operating Temp: 85°C; Part Type: Interface; Release Data: 2021-08-27T14:44:23; UBX Wiki: https://wiki.u-blox.com/bin/view/Operations/PartDetails?index=35482; RefDes: U; Manufacturer P/N: FT4232HL; Mfg P/N Datasheet: https://wiki.u-blox.com/bin/view/Generic/Docs/DocumentSummary?index=16016
U109 = UBXH10-0000054: FTDI USB TO SERIAL FULL UART INTERFACE QFN20; Manufacturer: FTDI Future Technology Devices International; Editor: adam.johansson; Env: ROHS; Permitted Use: Support Products; Perferred: PREF; Mfg P/N Status: Active; Mfg P/N Split: 100; Mfg P/N Released: Yes; Released by: jaka.bevk; Part Number: UBXH10-0000054; Value: FT231XQ-R; Min Operating Temp: -40°C; Max Operating Temp: 85°C; Part Type: Interface; UBX Wiki: https://wiki.u-blox.com/bin/view/Operations/PartDetails?index=27258; RefDes: U; Manufacturer P/N: FT231XQ-R; Mfg P/N Datasheet: https://wiki.u-blox.com/bin/view/Generic/Docs/DocumentSummary?index=33707; Release Data: 2022-03-08T12:58:15
X2 = 100-00006: XTAL, 4Pin, 12.0000MHz, 18pF, 20ppm, 4Pins; Manufacturer 1: Abracon LLC; Manufacturer Part Number 1: ABM8-12.000MHZ-B2-T; Part Name: XTAL 12MHz 18pF 20ppm 3225; Body Size: 3.2mm x 2.5mm; Item Phase: Unreleased; MFG Package: 4-SMD; Use in new designs: Yes; Voltage: None; Value: *; Part Number: 100-00006; Supplier 1: Digi-Key; Supplier Part Number 1: 535-9826-1-ND; Manufacturer 2: AVX Corporation; Manufacturer Part Number 2: CX3225GB12000P0HPQCC; Supplier 2: Digi-Key; Supplier Part Number 2: 1253-1168-1-ND; Height: 0.8mm; Max Operating Temp: 75; Min Operating Temp: -20; Pins: 4; Revision: None; UBX Code: None